# EAGLE board Welder_PSU (EAGLE 9.6.2), part 1 of 2
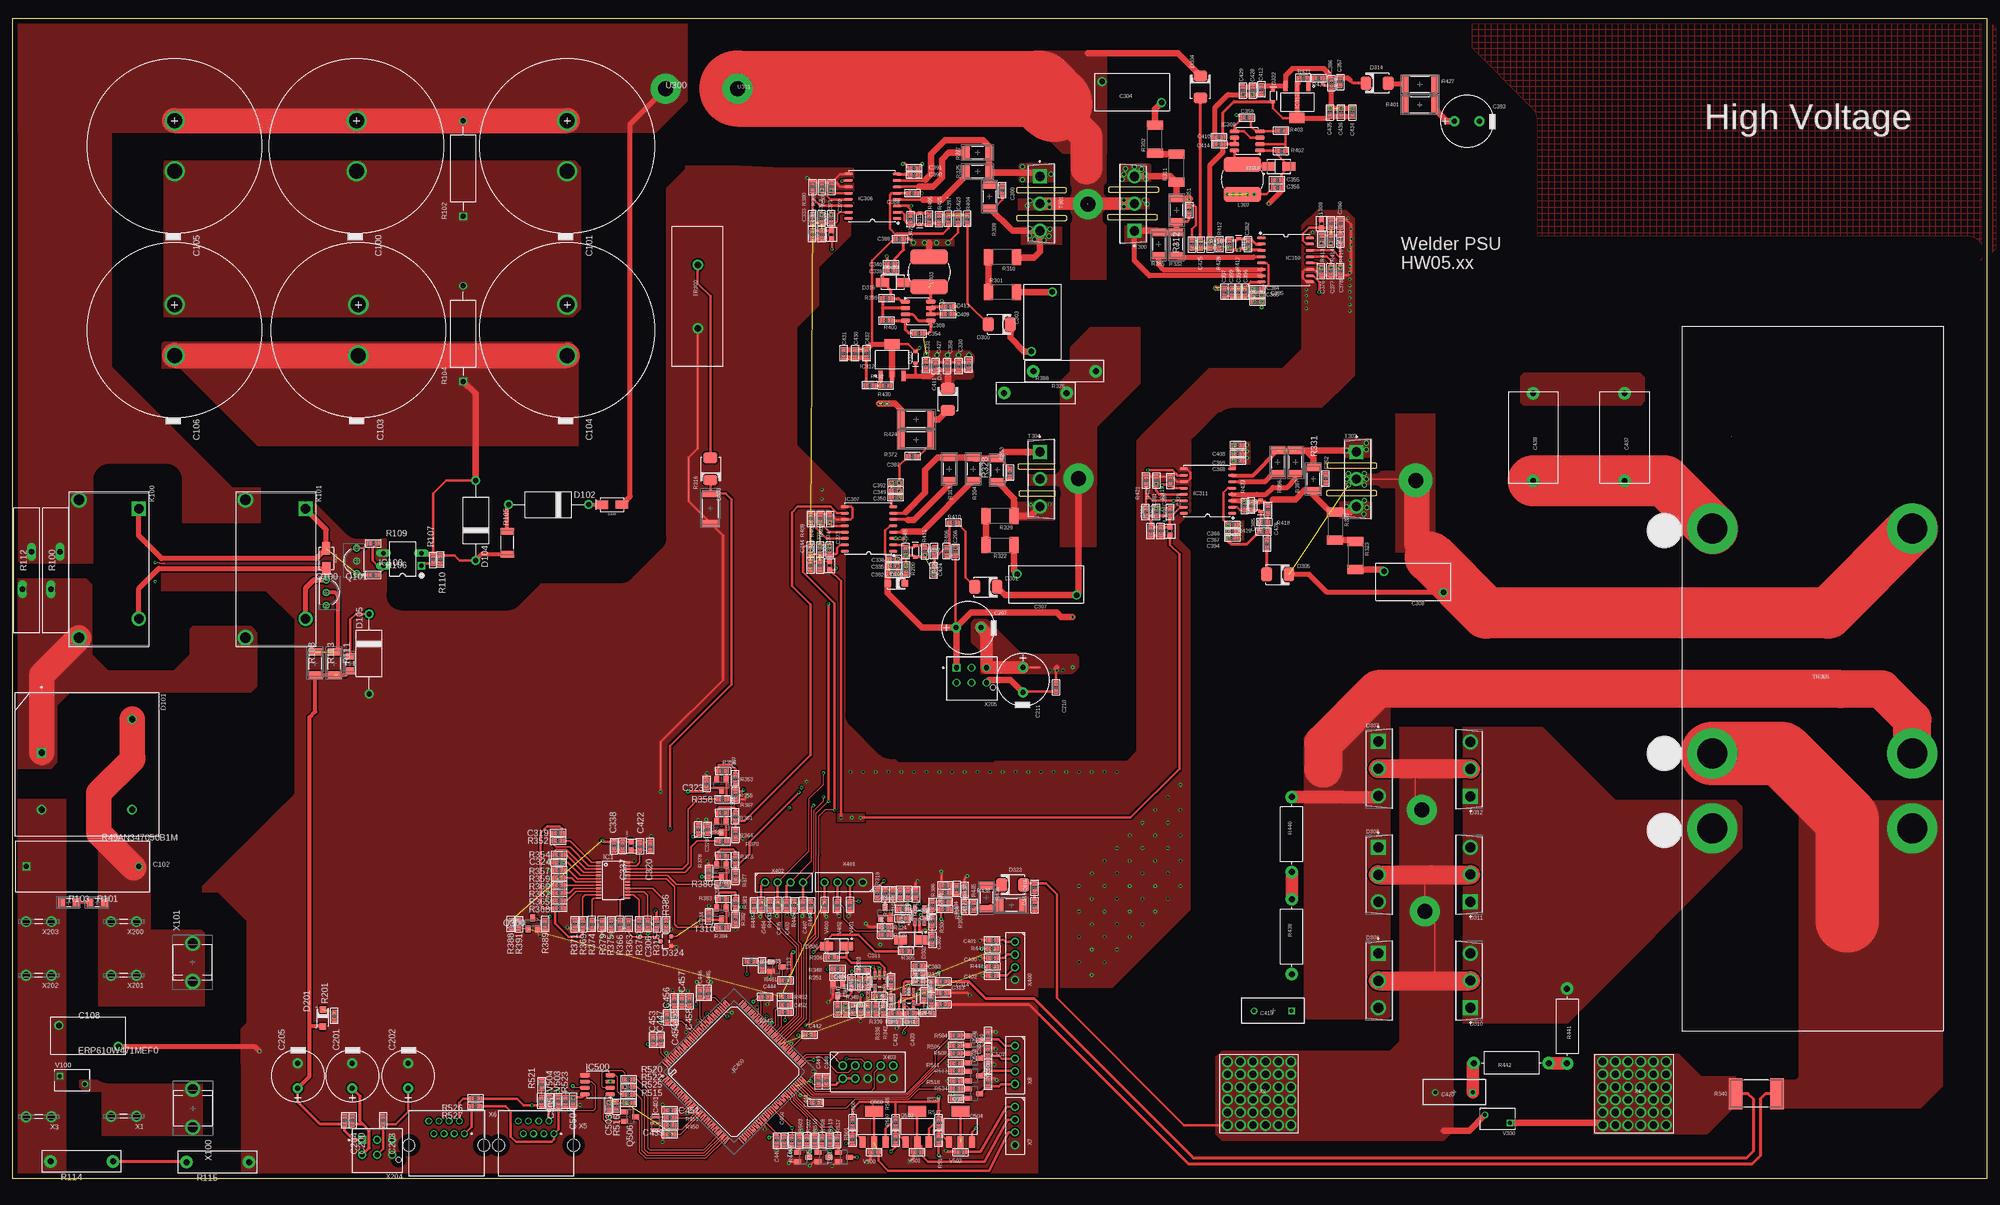
[diagram p6: board, top side]
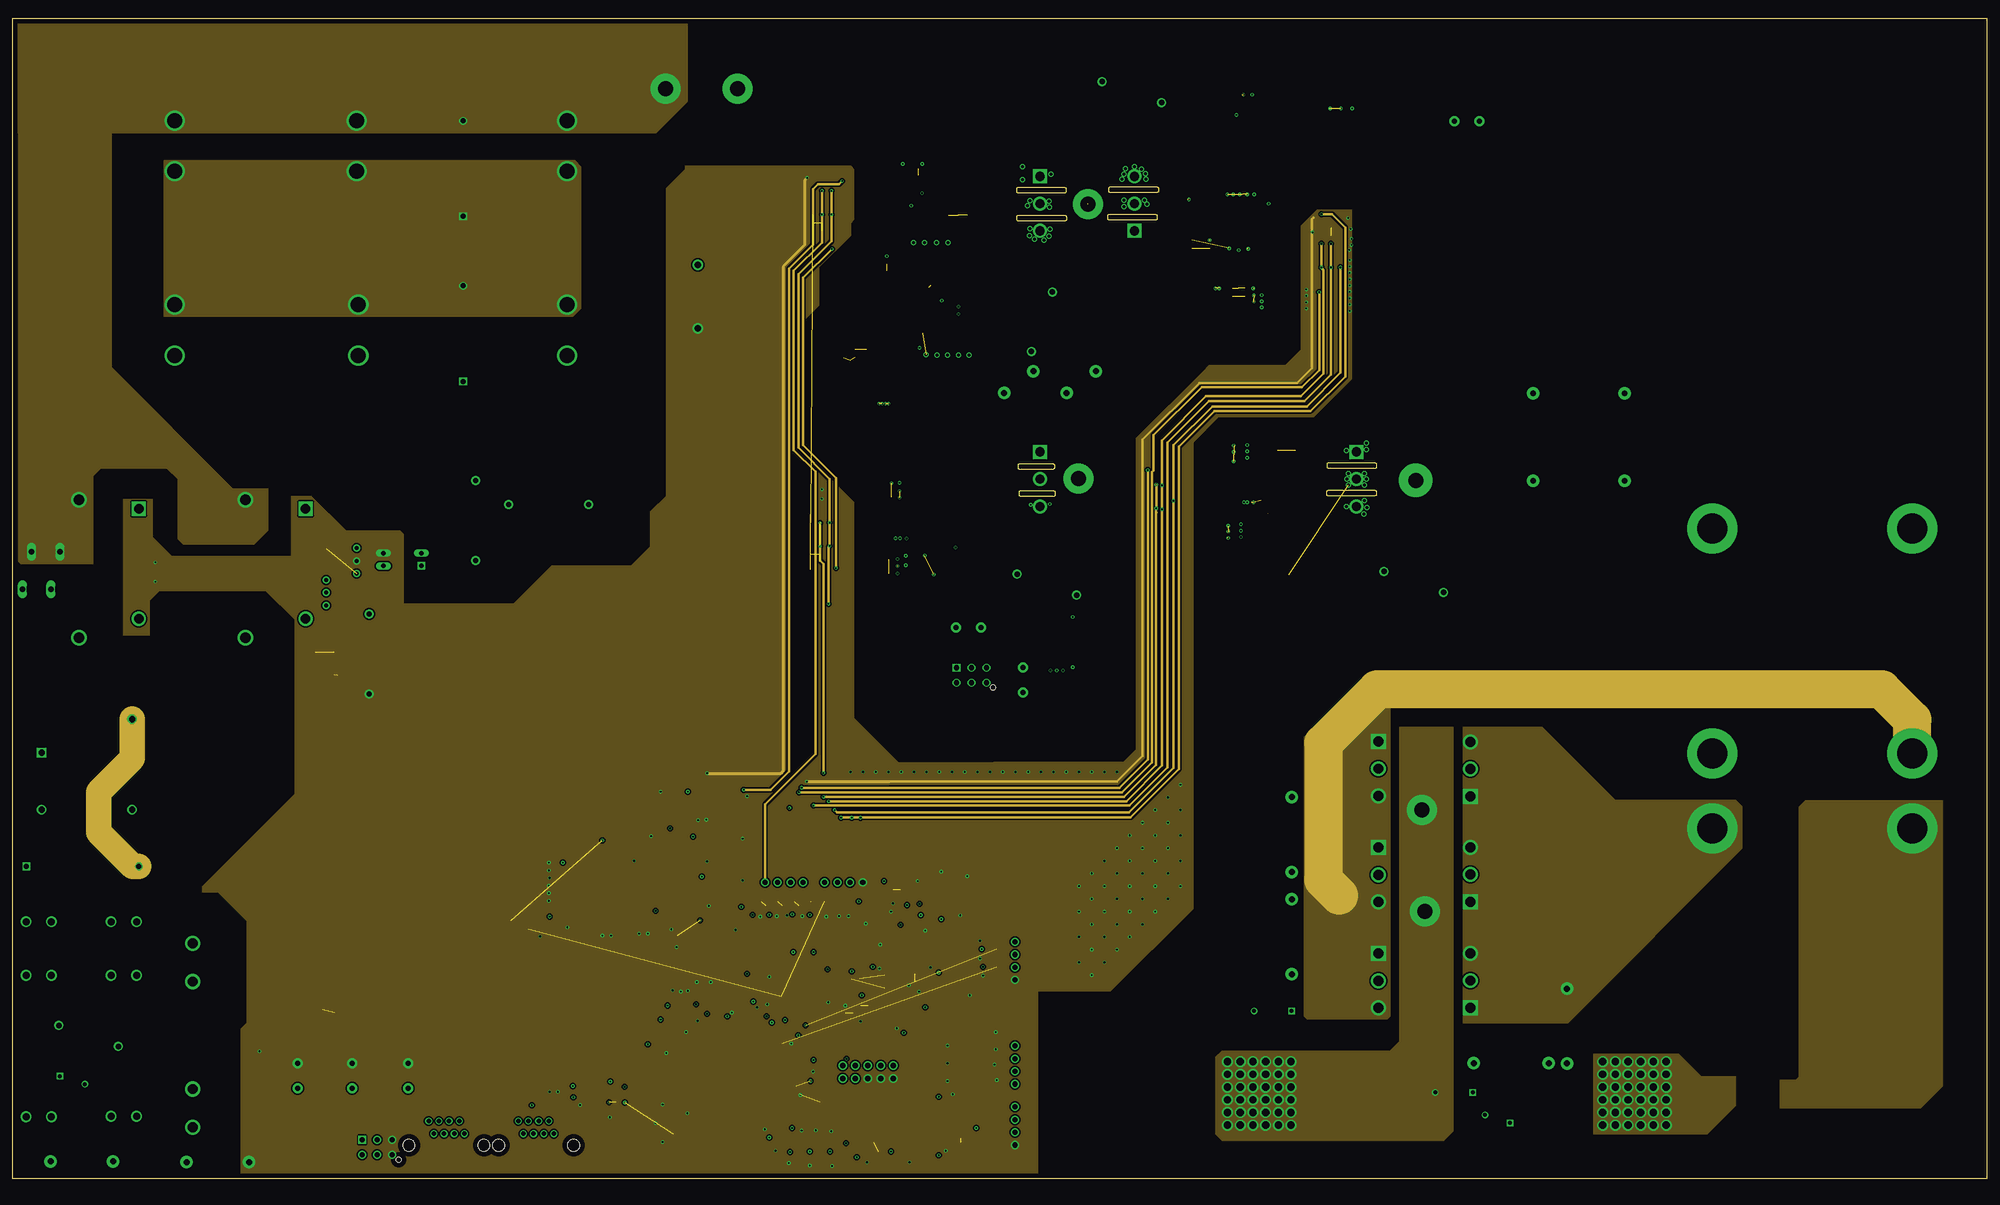
[diagram p7: board, inner layer L1]
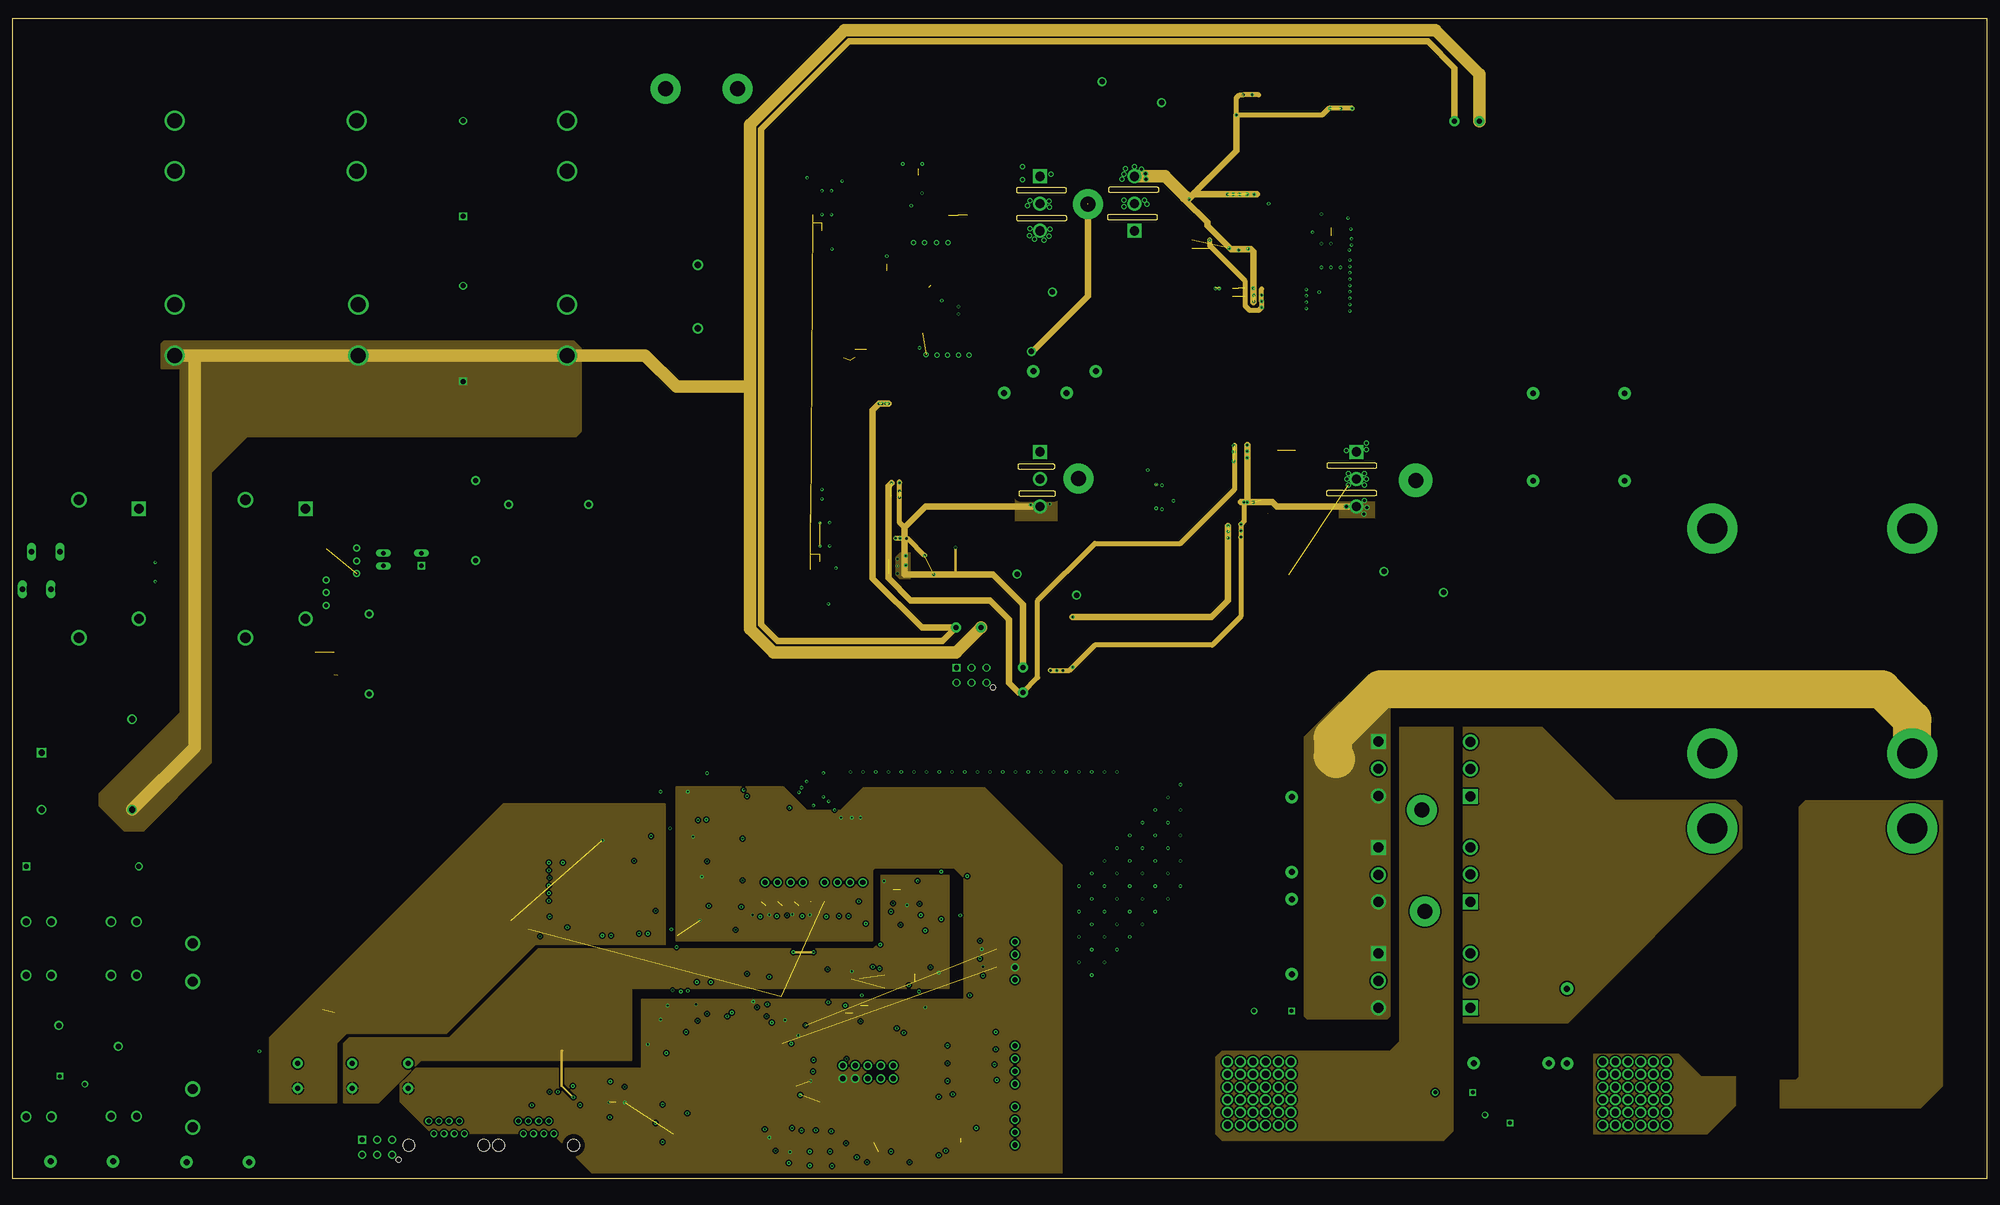
[diagram p8: board, inner layer L2]
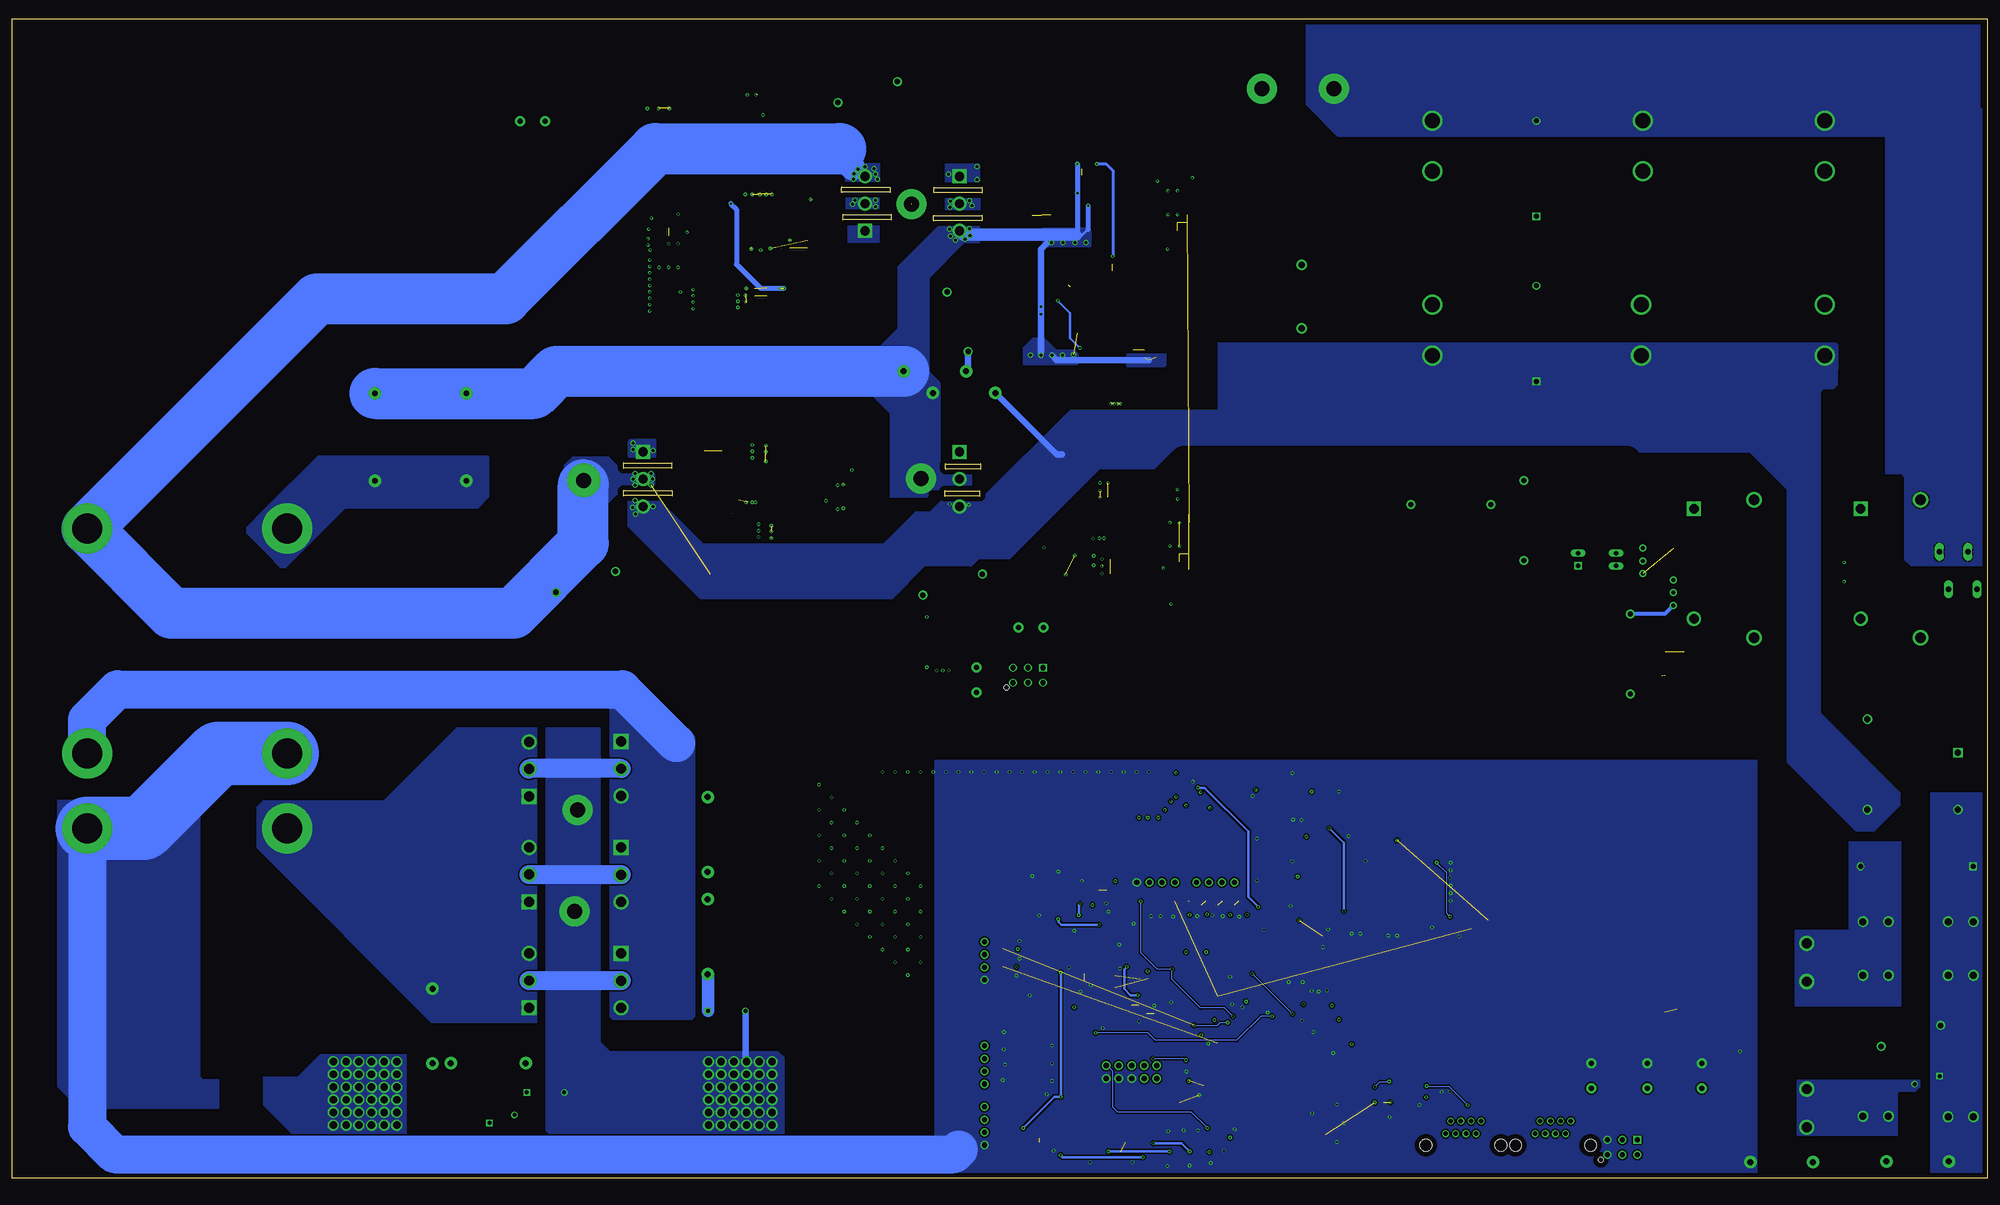
[diagram p9: board, bottom side, seen from below]

Size 395.02 x 232 mm. Coordinates in mm from the lower left corner, seen from the top.
Outline: 0,0 395.02,0 395.02,232 0,232 0,0
Outline: 201.07,191.62 210.67,191.62 arc90 210.82,191.77 210.82,192.43 arc90 210.62,192.63 201.07,192.63 arc90 200.97,192.53 200.97,191.72 arc90 201.07,191.62
Outline: 201.02,197.21 210.62,197.21 arc90 210.77,197.36 210.77,198.02 arc90 210.57,198.22 201.02,198.22 arc90 200.91,198.12 200.91,197.31 arc90 201.02,197.21
Outline: 219.51,197.26 229.11,197.26 arc90 229.26,197.41 229.26,198.07 arc90 229.06,198.27 219.51,198.27 arc90 219.41,198.17 219.41,197.36 arc90 219.51,197.26
Outline: 219.25,191.82 228.85,191.82 arc90 229.01,191.97 229.01,192.63 arc90 228.8,192.84 219.25,192.84 arc90 219.15,192.74 219.15,191.92 arc90 219.25,191.82
Outline: 201.37,141.88 208.28,141.88 arc90 208.43,142.04 208.43,142.7 arc90 208.23,142.9 201.37,142.9 arc90 201.27,142.8 201.27,141.99 arc90 201.37,141.88
Outline: 263.14,142.09 272.75,142.09 arc90 272.9,142.24 272.9,142.9 arc90 272.69,143.1 263.14,143.1 arc90 263.04,143 263.04,142.19 arc90 263.14,142.09
Outline: 263.09,136.55 272.69,136.55 arc90 272.85,136.7 272.85,137.36 arc90 272.64,137.57 263.09,137.57 arc90 262.99,137.47 262.99,136.65 arc90 263.09,136.55
Outline: 201.52,136.5 208.43,136.5 arc90 208.59,136.65 208.59,137.31 arc90 208.38,137.52 201.52,137.52 arc90 201.42,137.41 201.42,136.6 arc90 201.52,136.5
Copper layers (1+2*15+16): Top 0.07mm / dielectric 0.11mm / L1 0.035mm / dielectric 0.12mm / L2 0.035mm / dielectric 0.11mm / Bottom 0.07mm
Design rules "AH_V01 *": minimum track width 0.2mm, minimum drill 0.3mm, track to track 0.3mm, track to pad 0.3mm, pad to pad 0.3mm, via to via 0.3mm, smd to smd 0mil, copper to edge 40mil, drill to drill 6mil, minimum pad ring 0.2mm, minimum via ring 0.15mm, stop-mask expansion 4mil, vias tented up to drill 0mil, thermal gap 10mil
Net classes: 1 L_Net: width 0.2 mm, clearance 6 mm to class 0, clearance 0.2 mm; 2 N_Net: width 0.2 mm, clearance 6 mm to class 0, clearance 3.2 mm to class 1, clearance 0.2 mm; 3 HV_Net+: width 0.2 mm, clearance 6 mm to class 0, clearance 3.2 mm to class 1, clearance 3.2 mm to class 2, clearance 0.2 mm; 4 HV_Net-: width 0.2 mm, clearance 6 mm to class 0, clearance 3.2 mm to class 1, clearance 3.2 mm to class 2, clearance 3.2 mm to class 3, clearance 0.2 mm; 5 MV_Net: width 0.2 mm, clearance 6 mm to class 0, clearance 1 mm to class 1, clearance 1 mm to class 2, clearance 2 mm to class 3, clearance 2 mm to class 4, clearance 0.2 mm; 6 LV_Net: width 0.2 mm, clearance 0.2 mm to class 0, clearance 6 mm to class 1, clearance 6 mm to class 2, clearance 6 mm to class 3, clearance 6 mm to class 4, clearance 6 mm to class 5, clearance 0.2 mm; 9 Weld+: clearance 1.4 mm to class 7
tRestrict: 82 lines
bRestrict: 15 lines

## Footprints (pad centres in the part's own frame; a part is rotated, then mirrored left to right if it is on the bottom)
CAPACITOR-ELKO-400V-RM10-35X50 = drill 3 pad 4: 1 -5.08,0; 2 5.08,0
R49AN347050B1M = drill 1 pad 1.55 square: 1 -11.25,0 | drill 1 pad 1.55: 2 11.25,0
CAPACITOR-FILM-RM12.5MM-12MM = drill 1.1 pad 1.8: 1 6,-2.5; 2 -5.9,1.7
EIA0603 = smd 1 x 1: 1 -0.8,0; 2 0.8,0
CAPACITOR-ELKO-RM5-10X16 = drill 1 pad 2: 1 -2.5,0; 2 2.5,0
C_DISC_P7.5D12 = drill 0.8 pad 1.3 square: 1 -3.75,0 | drill 0.8 pad 1.3: 2 3.75,0
CAPACITOR-FILM-RM17.5-28X17.5X25 = drill 1.1 pad 2.5: 1 -8.75,0; 2 8.75,0
SMA-DIODE = smd 2.5 x 1.6: A -2,0 | smd 2.5 x 1.7: C 2,0
GBPC3510W = drill 1.25 pad 1.9 square: 1 -2.35,-9.05 | drill 1.25 pad 1.9: 2 -9.05,9.05; 3 9.05,9.05; 4 9.05,-9.05
DO-201AD = drill 1 pad 1.8: A -8,0; K 8,0
SMD1206-LED = smd 1.3 x 1.3: 1 -1.7,0; 2 1.7,0
SMB = smd 2.16 x 2.74: A -2.21,0; K 2.21,0
SMA = smd 2.65 x 1.75: 1 -2.015,0; 2 2.015,0
TO-247AD = drill 1.99 square: 1 -0.227,5.46 | drill 1.99: 2 -0.227,0; 3 -0.227,-5.46
SOD-323 = smd 0.63 x 0.83: A 1.15,0; C -1.15,0
SOT23DUALDIODE = smd 0.8 x 0.9: 1 -0.95,-1.05; 2 0.95,-1.05; 3 0,1.05
TSSOP24 = smd 0.305 x 0.991: 1 -3.575,-2.918; 2 -2.925,-2.918; 3 -2.275,-2.918; 4 -1.625,-2.918; 5 -0.975,-2.918; 6 -0.325,-2.918; 7 0.325,-2.918; 8 0.975,-2.918; 9 1.625,-2.918; 10 2.275,-2.918; 11 2.925,-2.918; 12 3.575,-2.918; 13 3.575,2.918; 14 2.925,2.918; 15 2.275,2.918; 16 1.625,2.918; 17 0.975,2.918; 18 0.325,2.918; 19 -0.325,2.918; 20 -0.975,2.918; 21 -1.625,2.918; 22 -2.275,2.918; 23 -2.925,2.918; 24 -3.575,2.918
DIP04 = drill 0.9 pad 1.5 square: 1 -3.81,1.27 | drill 0.9 pad 1.5 long: 2 -3.81,-1.27; 3 3.81,-1.27; 4 3.81,1.27
SOT-23-5 = smd 1.626 x 0.61: 1 -1.245,0.95; 2 -1.245,0; 3 -1.245,-0.95; 4 1.245,-0.95; 5 1.245,0.95
SOIC16_WIDE_HV = smd 1.65 x 0.6: 1 -4.855,4.445; 2 -4.855,3.175; 3 -4.855,1.905; 4 -4.855,0.635; 5 -4.855,-0.635; 6 -4.855,-1.905; 7 -4.855,-3.175; 8 -4.855,-4.445; 9 4.855,-4.445; 10 4.855,-3.175; 11 4.855,-1.905; 12 4.855,-0.635; 13 4.855,0.635; 14 4.855,1.905; 15 4.855,3.175; 16 4.855,4.445
SOIC8 = smd 1.9 x 0.72: 1 -2.54,1.905; 2 -2.54,0.635; 3 -2.54,-0.635; 4 -2.54,-1.905; 5 2.54,-1.905; 6 2.54,-0.635; 7 2.54,0.635; 8 2.54,1.905
SOT223_LM317AEMP = smd 2.05 x 1: 1 -3.175,2.3; 2 -3.175,0; 3 -3.175,-2.3 | smd 2.05 x 3.25: 4 3.175,0
LQFP-144-M = smd 1.45 x 0.3: 1 -10.725,8.75; 2 -10.725,8.25; 3 -10.725,7.75; 4 -10.725,7.25; 5 -10.725,6.75; 6 -10.725,6.25; 7 -10.725,5.75; 8 -10.725,5.25; 9 -10.725,4.75; 10 -10.725,4.25; 11 -10.725,3.75; 12 -10.725,3.25; 13 -10.725,2.75; 14 -10.725,2.25; 15 -10.725,1.75; 16 -10.725,1.25; 17 -10.725,0.75; 18 -10.725,0.25; 19 -10.725,-0.25; 20 -10.725,-0.75; 21 -10.725,-1.25; 22 -10.725,-1.75; 23 -10.725,-2.25; 24 -10.725,-2.75; 25 -10.725,-3.25; 26 -10.725,-3.75; 27 -10.725,-4.25; 28 -10.725,-4.75; 29 -10.725,-5.25; 30 -10.725,-5.75; 31 -10.725,-6.25; 32 -10.725,-6.75; 33 -10.725,-7.25; 34 -10.725,-7.75; 35 -10.725,-8.25; 36 -10.725,-8.75; 73 10.725,-8.75; 74 10.725,-8.25; 75 10.725,-7.75; 76 10.725,-7.25; 77 10.725,-6.75; 78 10.725,-6.25; 79 10.725,-5.75; 80 10.725,-5.25; 81 10.725,-4.75; 82 10.725,-4.25; 83 10.725,-3.75; 84 10.725,-3.25; 85 10.725,-2.75; 86 10.725,-2.25; 87 10.725,-1.75; 88 10.725,-1.25; 89 10.725,-0.75; 90 10.725,-0.25; 91 10.725,0.25; 92 10.725,0.75; 93 10.725,1.25; 94 10.725,1.75; 95 10.725,2.25; 96 10.725,2.75; 97 10.725,3.25; 98 10.725,3.75; 99 10.725,4.25; 100 10.725,4.75; 101 10.725,5.25; 102 10.725,5.75; 103 10.725,6.25; 104 10.725,6.75; 105 10.725,7.25; 106 10.725,7.75; 107 10.725,8.25; 108 10.725,8.75 | smd 0.3 x 1.45: 37 -8.75,-10.725; 38 -8.25,-10.725; 39 -7.75,-10.725; 40 -7.25,-10.725; 41 -6.75,-10.725; 42 -6.25,-10.725; 43 -5.75,-10.725; 44 -5.25,-10.725; 45 -4.75,-10.725; 46 -4.25,-10.725; 47 -3.75,-10.725; 48 -3.25,-10.725; 49 -2.75,-10.725; 50 -2.25,-10.725; 51 -1.75,-10.725; 52 -1.25,-10.725; 53 -0.75,-10.725; 54 -0.25,-10.725; 55 0.25,-10.725; 56 0.75,-10.725; 57 1.25,-10.725; 58 1.75,-10.725; 59 2.25,-10.725; 60 2.75,-10.725; 61 3.25,-10.725; 62 3.75,-10.725; 63 4.25,-10.725; 64 4.75,-10.725; 65 5.25,-10.725; 66 5.75,-10.725; 67 6.25,-10.725; 68 6.75,-10.725; 69 7.25,-10.725; 70 7.75,-10.725; 71 8.25,-10.725; 72 8.75,-10.725; 109 8.75,10.725; 110 8.25,10.725; 111 7.75,10.725; 112 7.25,10.725; 113 6.75,10.725; 114 6.25,10.725; 115 5.75,10.725; 116 5.25,10.725; 117 4.75,10.725; 118 4.25,10.725; 119 3.75,10.725; 120 3.25,10.725; 121 2.75,10.725; 122 2.25,10.725; 123 1.75,10.725; 124 1.25,10.725; 125 0.75,10.725; 126 0.25,10.725; 127 -0.25,10.725; 128 -0.75,10.725; 129 -1.25,10.725; 130 -1.75,10.725; 131 -2.25,10.725; 132 -2.75,10.725; 133 -3.25,10.725; 134 -3.75,10.725; 135 -4.25,10.725; 136 -4.75,10.725; 137 -5.25,10.725; 138 -5.75,10.725; 139 -6.25,10.725; 140 -6.75,10.725; 141 -7.25,10.725; 142 -7.75,10.725; 143 -8.25,10.725; 144 -8.75,10.725
CSTNE8M00G520000R0 = smd 0.4 x 1.9: 1 -1.2,0; 2 0,0; 3 1.2,0
PANASONIC_ALFG2PF09_0 = drill 1.9 pad 2.4 square: 1 0,0 | drill 1.9 pad 2.4: 2 22,0 | drill 2.1 pad 2.6: 3 -1.8,-12; 4 25.8,-12
0603 = smd 1.1 x 1: 1 -0.85,0; 2 0.85,0
SRN8040TA-220M = smd 3 x 7.5: 1 -3,0; 2 3,0
TO-92 = drill 0.8 pad 1.4: 1 0,2.54; 2 0,0; 3 0,-2.54
SOT23 = smd 1 x 1.4: 1 -0.95,-1.1; 2 0.95,-1.1; 3 0,1.1
SOT223 = smd 1.219 x 2.235: 1 -2.311,-3.099; 2 0,-3.099; 3 2.311,-3.099 | smd 3.6 x 2.2: 4 0,3.099
VARISTOR_D25_P7.5 = drill 1.1 pad 1.8 long: 1 -3.75,0.925; 2 3.75,-0.925
EIA1206 = smd 1.3 x 1.8: 1 -1.45,0; 2 1.45,0
ERG-2S = drill 1 pad 1.55 square: 1 -9.555,0 | drill 1 pad 1.55: 2 9.555,0
R2010 = smd 1.256 x 2.658: 1 -2.301,0; 2 2.301,0
EIA2010 = smd 1.4 x 2.7: 1 -2.3,0; 2 2.3,0
RES-RM12.5-VR37 = drill 1.2 pad 2.5: 1 -6.25,0; 2 6.25,0
R2512 = smd 1.8 x 3.2: 1 -2.8,0; 2 2.8,0
EIA2512 = smd 1.3 x 3.4: 1 -2.95,0; 2 2.95,0
WSLP3921 = smd 2.7 x 6.2: 1 -4.15,0; 2 4.15,0
RES-RM15-RSF1W = drill 1.2 pad 2.5: 1 -7.5,0; 2 7.5,0
TO-247AC = drill 1.85 pad 2.8 square: 1 -0.227,5.46 | drill 1.85 pad 2.8: 2 -0.227,0; 3 -0.227,-5.46
CST206-2A = drill 1.27 pad 2.083: 1 -6.35,0; 2 6.35,0
11-0060-A = drill 6 pad 10: 1 -20,30; 2 -20,-15; 3 -20,-30; 4 20,-30; 5 20,-15; 6 20,30
PAD-3.0X6.0MM = drill 3 pad 6: 1 0,0
EPCOS_B72205S0271K101_0 = drill 0.8 pad 1.3 square: 1 -2.5,0.8 | drill 0.8 pad 1.3: 2 2.5,-0.8
TE_726386-2 = drill 1.4 pad 2.15: 1 -2.54,0; 1-2 2.54,0
X01_M10_7461061 = drill 1.45 pad 2.2: 1 -6.35,-6.35; 1-1 -3.81,-6.35; 1-2 -1.27,-6.35; 1-3 1.27,-6.35; 1-4 -6.35,-3.81; 1-5 -3.81,-3.81; 1-6 -1.27,-3.81; 1-7 1.27,-3.81; 1-8 -6.35,-1.27; 1-9 -3.81,-1.27; 1-10 -1.27,-1.27; 1-11 1.27,-1.27; 1-12 -6.35,1.27; 1-13 -3.81,1.27; 1-14 -1.27,1.27; 1-15 1.27,1.27; 1-16 3.81,-6.35; 1-17 3.81,-3.81; 1-18 3.81,-1.27; 1-19 3.81,1.27; 1-20 3.81,3.81; 1-21 1.27,3.81; 1-22 -1.27,3.81; 1-23 -3.81,3.81; 1-24 -6.35,3.81; 1-25 6.35,-1.27; 1-26 6.35,-3.81; 1-27 6.35,-6.35; 1-28 6.35,1.27; 1-29 6.35,3.81; 1-30 -6.35,6.35; 1-31 -3.81,6.35; 1-32 -1.27,6.35; 1-33 1.27,6.35; 1-34 3.81,6.35; 1-35 6.35,6.35
615008148521 = drill 0.9: 1 3.57,1.875; 2 2.55,4.415; 3 1.53,1.875; 4 0.51,4.415; 5 -0.51,1.875; 6 -1.53,4.415; 7 -2.55,1.875; 8 -3.57,4.415 | hole 2.36: -7.5,-0.425; 7.5,-0.425
X04_100MIL = drill 1.016 pad 1.616: 1 0,0; 2 2.54,0; 3 5.08,0; 4 7.62,0
FUSE_CLIP_01020071Z = drill 1.98 pad 3.03: 1 3.81,0; 1-1 -3.81,0
MOLEX_206832-0601 = drill 1.02 pad 1.57 square: 1 3,-2.2 | drill 1.02 pad 1.57: 2 3,0.8; 3 0,-2.2; 4 0,0.8; 5 -3,-2.2; 6 -3,0.8 | hole 1.02: -4.28,1.78
X10_100MIL_2XROW_VERT = drill 1.1 pad 1.7: 1 -5.08,1.27; 2 -5.08,-1.27; 3 -2.54,1.27; 4 -2.54,-1.27; 5 0,1.27; 6 0,-1.27; 7 2.54,1.27; 8 2.54,-1.27; 9 5.08,1.27; 10 5.08,-1.27

## Placement (x,y rotation side)
C100  SLP152M250H9P3  [CAPACITOR-ELKO-400V-RM10-35X50]  68.82,206.53 270 top
C101  SLP152M250H9P3  [CAPACITOR-ELKO-400V-RM10-35X50]  110.98,206.53 270 top
C102  R49AN347050B1M  [R49AN347050B1M]  14.04,62.39 0 top
C103  SLP152M250H9P3  [CAPACITOR-ELKO-400V-RM10-35X50]  69.2,169.7 270 top
C104  SLP152M250H9P3  [CAPACITOR-ELKO-400V-RM10-35X50]  110.98,169.7 270 top
C105  SLP152M250H9P3  [CAPACITOR-ELKO-400V-RM10-35X50]  32.42,206.53 270 top
C106  SLP152M250H9P3  [CAPACITOR-ELKO-400V-RM10-35X50]  32.42,169.7 270 top
C108  ERP610W471MEF0  [CAPACITOR-FILM-RM12.5MM-12MM]  15.16,28.86 0 top
C200  100nF/50V  [EIA0603]  68,11.59 270 top
C201  50PX470MEFC10X20  [CAPACITOR-ELKO-RM5-10X16]  68,20.48 90 top
C202  50PX470MEFC10X20  [CAPACITOR-ELKO-RM5-10X16]  79.17,20.48 90 top
C203  100nF/50V  [EIA0603]  74.09,11.59 270 top
C204  100nF/50V  [EIA0603]  66.47,11.59 270 top
C205  50PX470MEFC10X20  [CAPACITOR-ELKO-RM5-10X16]  57.07,20.48 90 top
C206  100nF/50V  [EIA0603]  188.65,125.38 270 top
C207  50PX470MEFC10X20  [CAPACITOR-ELKO-RM5-10X16]  191.24,110.14 0 top
C210  100nF/50V  [EIA0603]  208.71,98.2 270 top
C211  50PX470MEFC10X20  [CAPACITOR-ELKO-RM5-10X16]  202.16,99.73 270 top
C300  470pF/50V  [EIA0603]  198.04,197.64 90 top
C301  12pF/50V  [EIA0603]  178.16,52.02 0 top
C302  510pF/50V  [EIA0603]  184,47.7 270 top
C303  HVCC153Y6P471MEAX  [CAPACITOR-FILM-RM12.5MM-12MM]  206.32,171.41 270 top
C304  HVCC153Y6P471MEAX  [CAPACITOR-FILM-RM12.5MM-12MM]  224,216.93 180 top
C305  100nF/50V  [EIA0603]  186.54,53.8 180 top
C306  330pF/50V  [EIA0603]  127.1,50.81 90 top
C307  HVCC153Y6P471MEAX  [CAPACITOR-FILM-RM12.5MM-12MM]  206.88,119.18 0 top
C308  HVCC153Y6P471MEAX  [CAPACITOR-FILM-RM12.5MM-12MM]  280.29,119.69 0 top
C309  100nF/50V  [EIA0603]  179.17,56.84 90 top
C310  100nF/50V  [EIA0603]  176.13,56.84 270 top
C311  12pF/50V  [EIA0603]  169.42,39.09 90 top
C312  510pF/50V  [EIA0603]  170.06,41.63 180 top
C313  10nF/50V  [EIA0603]  183.9,38.58 90 top
C314  1nF/50V  [EIA0603]  186.19,37.06 0 top
C315  22uF/16V  [EIA0603]  173.45,36.4 180 top
C316  10nF/50V  [EIA0603]  183.9,35.53 90 top
C317  100nF/50V  [EIA0603]  169.68,33.76 270 top
C318  100nF/50V  [EIA0603]  166.63,33.76 90 top
C319  1uF/25V  [EIA0603]  109.14,68.99 180 top
C320  100nF/50V  [EIA0603]  125.5,66.4 270 top
C323  100nF/50V  [EIA0603]  138.78,78.89 270 top
C324  100nF/50V  [EIA0603]  109.32,63.15 0 top
C325  1uF/25V  [EIA0603]  137.26,69.75 90 top
C328  100nF/50V  [EIA0603]  139.03,69.75 270 top
C329  100nF/50V  [EIA0603]  139.29,61.11 270 top
C330  100nF/100V  [EIA0603]  191.34,162.69 90 top
C331  10uF/25V  [EIA0603]  184.73,162.44 90 top
C332  100nF/50V  [EIA0603]  161.93,188.83 90 top
C333  100nF/50V  [EIA0603]  160.03,188.83 90 top
C334  100nF/50V  [EIA0603]  139.29,52.48 270 top
C335  100nF/50V  [EIA0603]  176.19,122.54 180 top
C336  10uF/35V  [EIA0603]  176.19,123.81 180 top
C337  1uF/25V  [EIA0603]  120.32,66.45 270 top
C338  100nF/50V  [EIA0603]  122.1,66.45 90 top
C339  10uF/35V  [EIA0603]  175.72,181.61 180 top
C340  4.7uF/50V  [EIA0603]  175.72,182.88 180 top
C342  1nF/50V  [EIA0603]  179.63,191.93 270 top
C343  100nF/50V  [EIA0603]  161.58,122.54 90 top
C344  1uF/50V  [EIA0603]  159.68,122.54 90 top
C345  1nF/50V  [EIA0603]  178.7,125.4 90 top
C346  100nF/50V  [EIA0603]  178.16,53.8 180 top
C347  100nF/50V  [EIA0603]  182.38,36.55 90 top
C348  100nF/50V  [EIA0603]  175.77,39.34 90 top
C349  100nF/50V  [EIA0603]  176.66,137.51 180 top
C350  2.2uF/35V  [EIA0603]  176.66,136.24 180 top
C351  470pF/50V  [EIA0603]  235.38,193.71 270 top
C352  470pF/50V  [EIA0603]  262.76,139.98 90 top
C353  470pF/50V  [EIA0603]  199.57,141.13 90 top
C354  100nF/50V  [EIA0603]  181.28,169.07 0 top
C355  10uF/35V  [EIA0603]  253.05,199.73 0 top
C356  4.7uF/50V  [EIA0603]  253.05,198.2 0 top
C357  100nF/100V  [EIA0603]  265.61,219.36 270 top
C358  10uF/35V  [EIA0603]  189.31,162.44 90 top
C359  100nF/25V  [EIA0603]  246.96,212.17 180 top
C360  1uF/35V  [EIA0603]  265.65,190.98 270 top
C361  100nF/50V  [EIA0603]  263.75,190.98 270 top
C362  1nF/50V  [EIA0603]  247.2,186.85 90 top
C363  100nF/50V  [EIA0603]  229.72,129.44 90 top
C364  100nF/50V  [EIA0603]  227.73,129.44 90 top
C365  1nF/50V  [EIA0603]  246.55,134.53 270 top
C366  100nF/50V  [EIA0603]  244.02,130.65 180 top
C367  10uF/35V  [EIA0603]  244.02,129.38 180 top
C368  100nF/50V  [EIA0603]  245.12,143.54 180 top
C369  2.2uF/35V  [EIA0603]  245.12,144.81 180 top
C370  100pF/50V  [EIA0603]  163.84,198.35 270 top
C371  100pF/50V  [EIA0603]  161.93,198.35 270 top
C372  100pF/50V  [EIA0603]  160.03,198.35 270 top
C373  100pF/50V  [EIA0603]  163.49,131.94 270 top
C374  100pF/50V  [EIA0603]  161.58,131.94 270 top
C375  100pF/50V  [EIA0603]  159.68,131.94 270 top
C376  100pF/50V  [EIA0603]  261.84,181.45 90 top
C377  100pF/50V  [EIA0603]  263.75,181.45 90 top
C378  100pF/50V  [EIA0603]  265.65,181.45 90 top
C379  100pF/50V  [EIA0603]  231.62,139.54 270 top
C380  100pF/50V  [EIA0603]  228.78,139.6 270 top
C381  100pF/50V  [EIA0603]  226.75,139.6 270 top
C382  10F/35V  [EIA0603]  176.16,120.95 180 top
C383  100pF/25V  [EIA0603]  181.32,42.5 180 top
C384  4.7uF/35V  [EIA0603]  249.11,177.96 0 top
C385  100nF/25V  [EIA0603]  249.11,176.69 0 top
C386  10uF/35V  [EIA0603]  263.83,219.11 270 top
C387  100nF/100V  [EIA0603]  180.01,144.43 180 top
C388  10uF/25V  [EIA0603]  180.01,197.01 180 top
C389  10uF/25V  [EIA0603]  177.47,187.87 180 top
C390  10uF/35V  [EIA0603]  180.32,200.73 180 top
C391  10uF/35V  [EIA0603]  180.32,202 180 top
C392  10uF/35V  [EIA0603]  176.66,139.12 180 top
C393  470uF/35V  [CAPACITOR-ELKO-RM5-10X16]  291.01,211.49 0 top
C394  10F/35V  [EIA0603]  244.01,128.18 180 top
C395  10uF/25V  [EIA0603]  249.11,175.42 0 top
C396  10uF/25V  [EIA0603]  246.57,177.32 90 top
C397  10uF/25V  [EIA0603]  242.49,177.32 90 top
C398  10uF/35V  [EIA0603]  245.3,177.32 90 top
C399  10uF/35V  [EIA0603]  244.03,177.32 90 top
C400  100nF/50V  [EIA0603]  196.01,44.1 0 top
C401  100nF/50V  [EIA0603]  196.01,47.66 0 top
C402  100nF/50V  [EIA0603]  196.01,40.55 0 top
C403  100nF/50V  [EIA0603]  154.87,54.62 90 top
C404  100nF/50V  [EIA0603]  149.79,54.62 90 top
C405  100nF/50V  [EIA0603]  153.09,54.62 90 top
C407  100nF/50V  [EIA0603]  158.17,54.62 90 top
C408  10uF/35V  [EIA0603]  245.12,146.59 180 top
C409  4.7uF/50V  [EIA0603]  187.12,172.88 180 top
C410  4.7uF/50V  [EIA0603]  241.37,208.36 0 top
C411  100nF/50V  [EIA0603]  182.7,162.69 270 top
C412  100nF/50V  [EIA0603]  249.88,217.83 90 top
C413  100nF/100V  [EIA0603]  187.12,174.4 0 top
C414  100nF/100V  [EIA0603]  241.37,206.84 180 top
C415  100nF/100V  [EIA0603]  204.45,58.17 270 top
C416  10uF/25V  [EIA0603]  186.61,58.58 180 top
C417  10uF/25V  [EIA0603]  190.48,57.66 90 top
C418  100nF/100V  [EIA0603]  204.45,54.62 270 top
C419  CK45-B3FD102KYVNA  [C_DISC_P7.5D12]  252.15,33.43 180 top
C420  CK45-B3FD102KYVNA  [C_DISC_P7.5D12]  288.4,17.18 180 top
C421  10nF/50V  [EIA0603]  176.45,31.23 180 top
C422  1uF/25V  [EIA0603]  127.6,66.4 90 top
C423  330pF/50V  [EIA0603]  189.15,191.93 90 top
C424  330pF/50V  [EIA0603]  184.33,121.57 90 top
C425  330pF/50V  [EIA0603]  235.92,186.85 270 top
C426  330pF/50V  [EIA0603]  251.13,133.76 270 top
C427  10uF/35V  [EIA0603]  187.02,162.44 90 top
C428  10uF/35V  [EIA0603]  248.1,217.63 270 top
C429  10uF/25V  [EIA0603]  246.07,217.63 270 top
C430  10uF/35V  [EIA0603]  168.58,165.01 90 top
C431  10uF/35V  [EIA0603]  166.29,165.01 90 top
C432  10uF/35V  [EIA0603]  170.87,165.01 90 top
C433  100pF/25V  [EIA0603]  179.75,31.23 180 top
C434  10uF/35V  [EIA0603]  268.04,213.24 270 top
C435  10uF/35V  [EIA0603]  263.47,213.24 270 top
C436  10uF/35V  [EIA0603]  265.75,213.24 270 top
C437  ECW-F4245JLB  [CAPACITOR-FILM-RM17.5-28X17.5X25]  322.5,148.24 270 top
C438  ECW-F4245JLB  [CAPACITOR-FILM-RM17.5-28X17.5X25]  304.22,148.24 270 top
C439  100nF/50V  [EIA0603]  131.5,8.8 0 top
C440  100nF/50V  [EIA0603]  152.86,7.53 270 top
C441  100nF/50V  [EIA0603]  160.73,15.15 0 top
C442  100nF/50V  [EIA0603]  159.39,28.68 180 top
C443  100nF/50V  [EIA0603]  154.61,33.18 180 top
C444  100nF/50V  [EIA0603]  150.55,36.23 180 top
C445  100nF/50V  [EIA0603]  139.12,36.99 90 top
C446  100nF/50V  [EIA0603]  137.59,36.99 90 top
C447  100nF/50V  [EIA0603]  129.72,27.59 90 top
C448  1uF/35V  [EIA0603]  162.74,19.46 270 top
C449  100nF/50V  [EIA0603]  161.21,19.46 270 top
C450  100nF/50V  [EIA0603]  154.38,7.53 270 top
C451  100nF/50V  [EIA0603]  131.52,13.62 0 top
C452  100nF/50V  [EIA0603]  154.61,34.7 0 top
C453  1uF/50V  [EIA0603]  128.19,27.59 90 top
C454  1uF/35V  [EIA0603]  132.51,32.16 90 top
C455  1uF/35V  [EIA0603]  132.45,35.36 90 top
C456  100nF/50V  [EIA0603]  130.99,32.16 90 top
C457  100nF/50V  [EIA0603]  133.98,35.36 90 top
C458  10uF/16V  [EIA0603]  135.5,35.36 90 top
C500  100nF/50V  [EIA0603]  195.17,28.59 90 top
C501  100nF/50V  [EIA0603]  195.17,25.29 90 top
C502  100nF/50V  [EIA0603]  195.17,22.24 90 top
C503  100nF/50V  [EIA0603]  119.33,14.38 90 top
C504  100nF/50V  [EIA0603]  112.19,15.4 90 top
C505  100nF/50V  [EIA0603]  105.84,18.66 270 top
C506  100nF/50V  [EIA0603]  195.17,19.2 90 top
D100  RS1M-13-F  [SMA-DIODE]  119.94,134.78 180 top
D101  GBPC3510W  [GBPC3510W]  14.9,82.8 270 top
D102  1N5387BRLG  [DO-201AD]  107.24,134.78 0 top
D103  RS1M-13-F  [SMA-DIODE]  62.79,123.98 270 top
D104  1N4739A  [DO-201AD]  92.63,131.6 270 top
D105  1N4739A  [DO-201AD]  71.36,104.91 90 top
D200  26-21/GPC-F3138B/CA  [SMD1206-LED]  176.79,119.05 0 top
D201  26-21/GPC-F3138B/CA  [SMD1206-LED]  62.1,32.05 90 top
D300  STTH1R04USMB  [SMB]  197.44,170.85 0 top
D301  STTH1R04USMB  [SMB]  194.74,118.32 0 top
D302  SS14  [SMA]  179.68,47.7 180 top
D303  STTH1R04USMB  [SMB]  139.62,141.89 270 top
D304  STTH1R04USMB  [SMB]  237.67,218.35 90 top
D305  STTH1R04USMB  [SMB]  253.16,120.81 0 top
D306  SS14  [SMA]  164.85,46.46 180 top
D307  FEP30DP-E3/45TO-247AD  [TO-247AD]  273.45,81.93 0 top
D308  FEP30DP-E3/45TO-247AD  [TO-247AD]  273.45,60.72 0 top
D309  FEP30DP-E3/45TO-247AD  [TO-247AD]  273.45,39.51 0 top
D310  FEP30DP-E3/45TO-247AD  [TO-247AD]  291.45,39.53 180 top
D311  FEP30DP-E3/45TO-247AD  [TO-247AD]  291.45,60.76 180 top
D312  FEP30DP-E3/45TO-247AD  [TO-247AD]  291.45,81.84 180 top
D313  GB02SLT12-214  [SMB]  187.12,155.86 90 top
D314  GB02SLT12-214  [SMB]  272.97,219.11 180 top
D315  SD103AW  [SOD-323]  181.53,191.93 90 top
D316  SS14  [SMA]  176.1,179.2 180 top
D317  SD103AW  [SOD-323]  180.6,125.4 270 top
D318  SS14  [SMA]  253.36,202.46 0 top
D319  SD103AW  [SOD-323]  245.3,186.85 270 top
D320  SD103AW  [SOD-323]  249.72,134.53 90 top
D321  SD103AW  [SOD-323]  180.67,164.22 90 top
D322  SD103AW  [SOD-323]  252.19,216.56 270 top
D323  STTH1R04USMB  [SMB]  200.13,58.68 180 top
D324  BAT54S  [SOT23DUALDIODE]  130.73,47.4 90 top
IC1  UCC28951PWR  [TSSOP24]  120.18,59.6 270 top
IC100  PC817  [DIP04]  78.03,123.77 180 top
IC300  LMV641  [SOT-23-5]  181.46,52.53 90 top
IC301  LMV641  [SOT-23-5]  179.33,36.04 270 top
IC302  LMV641  [SOT-23-5]  173.49,39.34 270 top
IC306  UCC21710  [SOIC16_WIDE_HV]  172.09,196.45 180 top
IC307  UCC21710  [SOIC16_WIDE_HV]  171.35,129.89 180 top
IC308  MAX764CSA+  [SOIC8]  181.18,173.48 0 top
IC309  MAX764CSA+  [SOIC8]  247.01,207.54 180 top
IC310  UCC21710  [SOIC16_WIDE_HV]  254.73,183.74 0 top
IC311  UCC21710  [SOIC16_WIDE_HV]  239.15,137.45 180 top
IC312  LM317AEMP  [SOT223_LM317AEMP]  175.97,163.71 90 top
IC313  LM317AEMP  [SOT223_LM317AEMP]  256.97,215.3 270 top
IC400  R7FA6M5BG3CFBLQFP-144-M  [LQFP-144-M]  144.38,21.3 45 top
IC401  CSTNE8M00G520000R0  [CSTNE8M00G520000R0]  128.65,11.02 270 top
IC500  SN65HVD3082EDR  [SOIC8]  117.05,18.7 180 top
K100  PANASONIC_ALFG2PF09PANASONIC_ALFG2PF09_0_0  [PANASONIC_ALFG2PF09_0]  25.26,133.91 270 top
K101  PANASONIC_ALFG2PF09PANASONIC_ALFG2PF09_0_0  [PANASONIC_ALFG2PF09_0]  58.64,133.93 270 top
L300  BLM18RK601SN1D  [0603]  123.79,66.45 90 top
L302  BLM18RK601SN1D  [0603]  163.84,188.83 90 top
L303  SRN8040TA-220M  [SRN8040TA-220M]  183.4,181.31 270 top
L304  BLM18RK601SN1D  [0603]  163.49,122.54 90 top
L307  SRN8040TA-220M  [SRN8040TA-220M]  246.05,199.85 90 top
L308  BLM18RK601SN1D  [0603]  261.84,190.98 270 top
L309  BLM18RK601SN1D  [0603]  231.57,129.44 90 top
Q100  BC640TA  [TO-92]  68.88,123.51 180 top
Q101  KSD1616AYTA  [TO-92]  62.79,117.16 0 top
Q300  2N7002  [SOT23]  104.09,51.01 0 top
Q306  2N7002  [SOT23]  165.1,37.57 180 top
Q500  DMP6185SEQ-13  [SOT223]  172.37,10.32 0 top
Q501  BC817  [SOT23]  192.37,27.58 270 top
Q502  DMP6185SEQ-13  [SOT223]  181.01,10.32 0 top
Q503  BC817  [SOT23]  192.37,24.02 270 top
Q504  DMP6185SEQ-13  [SOT223]  189.64,10.32 0 top
Q505  BC817  [SOT23]  192.37,20.47 270 top
Q506  BC817  [SOT23]  123.57,12.31 270 top
Q507  BC817  [SOT23]  192.37,16.91 270 top
R100  B57364S100M54  [VARISTOR_D25_P7.5]  8.61,121.55 90 top
R101  R_1206EIA1206  [EIA1206]  16.94,55.22 0 top
R102  ERG-2SJ513  [ERG-2S]  90.15,202.01 90 top
R103  R_1206EIA1206  [EIA1206]  11.23,55.22 0 top
R104  ERG-2SJ513  [ERG-2S]  90.15,168.99 90 top
R105  82K 1%  [R2010]  98.98,127.16 90 top
R106  0R  [EIA0603]  72.19,120.72 0 top
R107  330R 1%  [EIA0603]  85.65,123.77 90 top
R108  R_2010EIA2010  [EIA2010]  60.55,103 90 top
R109  330R 1%  [EIA0603]  72.19,127.07 0 top
R110  220K 1%  [EIA0603]  84.12,123.77 270 top
R111  R_1206EIA1206  [EIA1206]  67.54,103 90 top
R112  B57364S100M54  [VARISTOR_D25_P7.5]  2.9,121.55 90 top
R113  R_2010EIA2010  [EIA2010]  64.36,103 90 top
R114  RNF12FTD10M0  [RES-RM12.5-VR37]  13.89,3.33 180 top
R115  RNF12FTD10M0  [RES-RM12.5-VR37]  41.07,3.21 180 top
R200  1K 1%  [EIA0603]  178.71,121.82 270 top
R201  3.3K 1%  [EIA0603]  64.44,32.42 90 top
R300  100K 1%  [EIA0603]  184,51.26 270 top
R301  47R 1%  [R2512]  198.04,177.32 0 top
R302  47R 1%  [R2512]  228.52,207.93 90 top
R303  4.7K 1%  [EIA0603]  163.84,192 90 top
R304  33R 1%  [EIA2010]  192.2,141.89 270 top
R305  10K 1%  [EIA0603]  178.67,45.41 180 top
R306  10K 1%  [EIA0603]  184,54.56 270 top
R307  10K 1%  [EIA0603]  186.61,57.06 180 top
R308  4.7k 1%  [EIA0603]  161.93,192 90 top
R309  1K 1%  [EIA2010]  195.5,196.37 90 top
R310  47R 1%  [R2512]  198.04,184.31 180 top
R311  47R 1%  [R2512]  232.84,202.09 90 top
R312  1K 1%  [EIA2010]  232.84,193.71 270 top
R313  33R 1%  [EIA2010]  187.38,141.89 270 top
R314  10k 1%  [EIA0603]  186.54,55.32 0 top
R315  1K 1%  [EIA0603]  128.87,50.81 270 top
R316  12R 1%  [EIA2512]  139.62,134.02 90 top
R317  10K 1%  [EIA0603]  177.65,56.84 90 top
R318  10K 1%  [EIA0603]  174.6,56.84 270 top
R319  10K 1%  [EIA0603]  173.08,56.84 90 top
R320  10K 1%  [EIA0603]  174.6,48.72 0 top
R321  10K 1%  [EIA0603]  180.7,56.84 270 top
R322  47R 1%  [R2512]  197.54,126.65 0 top
R323  47R 1%  [R2512]  268.66,124.62 270 top
R324  10K 1%  [EIA0603]  174.6,50.24 0 top
R325  33R 1%  [EIA2010]  193.02,201.37 180 top
R326  RNF12FTD10M0  [RES-RM12.5-VR37]  210.49,161.45 180 top
R327  22R 1%  [EIA2010]  193.02,205.18 180 top
R328  1K 1%  [EIA2010]  197.03,141.64 90 top
R329  47R 1%  [R2512]  197.54,132.49 180 top
R330  47R 1%  [R2512]  264.59,130.46 270 top
R331  1K 1%  [EIA2010]  260.27,139.85 90 top
R332  33R 1%  [EIA2010]  232.84,186.85 270 top
R333  150K 1%  [EIA0603]  170.95,39.09 90 top
R334  100K 1%  [EIA0603]  181.36,40.87 0 top
R335  1.5K 1%  [EIA0603]  186.19,39.34 180 top
R336  10K 1%  [EIA0603]  163.83,44.17 180 top
R337  510R 1%  [EIA0603]  181.36,39.34 180 top
R338  33K 1%  [EIA0603]  172.72,33.76 90 top
R339  162R 1%  [EIA0603]  176.53,32.99 180 top
R340  WSL5931L3000FEA  [WSLP3921]  348.85,16.92 180 top
R341  510R 1%  [EIA0603]  183.14,32.99 180 top
R342  220k 1%  [EIA0603]  174.25,33.76 90 top
R343  10k 1%  [EIA0603]  175.77,35.28 90 top
R344  1.5K 1%  [EIA0603]  186.19,34.77 180 top
R345  100K 1%  [EIA0603]  179.71,32.99 180 top
R346  3.3K 1%  [EIA0603]  168.15,33.76 270 top
R347  3.3K 1%  [EIA0603]  165.1,33.76 90 top
R348  3.3K 1%  [EIA0603]  167.9,39.09 90 top
R349  1K 1%  [EIA0603]  165.1,41.88 0 top
R350  10K 1%  [EIA0603]  171.2,33.76 90 top
R351  10K 1%  [EIA0603]  165.1,40.36 0 top
R352  10R 1%  [EIA0603]  109.14,67.47 180 top
R353  0R 1%  [EIA0603]  144.62,79.91 90 top
R354  10R 1%  [EIA0603]  109.32,64.67 180 top
R355  412R 1%  [EIA0603]  144.62,76.61 270 top
R356  1.2K 1%  [EIA0603]  142.08,81.43 180 top
R357  49.9K 1%  [EIA0603]  109.32,61.62 180 top
R358  10R 1%  [EIA0603]  142.08,75.85 0 top
R359  49.9K 1%  [EIA0603]  109.32,60.1 180 top
R360  65K 1%  [EIA0603]  109.32,58.57 180 top
R361  0R 1%  [EIA0603]  144.62,72.29 90 top
R362  65K 1%  [EIA0603]  109.32,57.05 180 top
R363  10K 1%  [EIA0603]  123.29,50.81 90 top
R364  412R 1%  [EIA0603]  144.62,68.73 270 top
R365  100K 1%  [EIA0603]  109.32,55.53 180 top
R366  10K 1%  [EIA0603]  121.51,50.81 90 top
R367  1.2K 1%  [EIA0603]  142.08,73.05 180 top
R368  100K 1%  [EIA0603]  109.32,54 180 top
R369  150K 1%  [EIA0603]  114.1,50.81 270 top
R370  10R 1%  [EIA0603]  142.08,67.46 0 top
R371  18K 1%  [EIA0603]  112.45,50.81 270 top
R372  10R 1%  [EIA2512]  180.77,147.73 180 top
R373  0R 1%  [EIA0603]  144.62,63.65 90 top
R374  18K 1%  [EIA0603]  115.92,50.81 90 top
R375  620R 1%  [EIA0603]  119.73,50.81 270 top
R376  620R 1%  [EIA0603]  125.32,50.81 270 top
R377  412R 1%  [EIA0603]  144.62,60.35 270 top
R378  1.2K 1%  [EIA0603]  142.08,64.42 180 top
R379  0R 1%  [EIA0603]  117.95,50.81 90 top
R380  10R 1%  [EIA0603]  142.08,58.83 0 top
R381  0R 1%  [EIA0603]  144.62,55.02 90 top
R382  412R 1%  [EIA0603]  144.62,51.72 270 top
R383  1.2K 1%  [EIA0603]  142.08,55.78 180 top
R384  10R 1%  [EIA0603]  142.08,50.19 0 top
R385  22R 1%  [EIA2010]  229.29,186.85 270 top
R386  10K 1%  [EIA0603]  130.73,50.81 270 top
R387  33R 1%  [EIA2010]  256.63,143.24 270 top
R388  10K 1%  [EIA0603]  99.72,50.81 90 top
R389  825K 1%  [EIA0603]  106.58,50.81 90 top
R390  4.7k 1%  [EIA0603]  160.03,192 90 top
R391  3.3K 1%  [EIA0603]  101.28,50.81 270 top
R396  33R 1%  [EIA2010]  253.08,143.24 270 top
R397  5.6K 1%  [EIA0603]  187.25,191.93 90 top
R398  RNF12FTD10M0  [RES-RM12.5-VR37]  204.65,157.13 0 top
R399  33K 1%  [EIA0603]  174.83,176.02 180 top
R400  10k 1%  [EIA0603]  174.83,171.58 180 top
R401  10R 1%  [EIA2512]  281.59,214.82 0 top
R402  33K 1%  [EIA0603]  253.82,205.57 0 top
R403  10k 1%  [EIA0603]  253.82,209.63 0 top
R404  220R 1%  [EIA0603]  191.06,191.93 90 top
R405  2.2K 1%  [EIA0603]  183.44,191.93 90 top
R406  5.6K 1%  [EIA0603]  186.95,125.4 90 top
R407  4.7K 1%  [EIA0603]  163.49,125.72 90 top
R408  4.7k 1%  [EIA0603]  161.58,125.72 90 top
R409  4.7k 1%  [EIA0603]  159.68,125.72 90 top
R410  220R 1%  [EIA0603]  188.22,131.11 180 top
R411  2.2K 1%  [EIA0603]  182.51,125.4 270 top
R412  5.6K 1%  [EIA0603]  241.49,186.85 90 top
R413  4.7K 1%  [EIA0603]  261.84,187.8 270 top
R414  4.7k 1%  [EIA0603]  263.75,187.8 270 top
R415  4.7k 1%  [EIA0603]  265.65,187.8 270 top
R416  220R 1%  [EIA0603]  237.68,186.85 270 top
R417  2.2K 1%  [EIA0603]  243.39,186.85 270 top
R418  5.6K 1%  [EIA0603]  250.36,129.45 0 top
R419  4.7K 1%  [EIA0603]  231.62,133.25 90 top
R420  4.7k 1%  [EIA0603]  228.78,133.25 90 top
R421  4.7k 1%  [EIA0603]  226.75,133.25 90 top
R422  220R 1%  [EIA0603]  250.99,126.91 90 top
R423  2.2K 1%  [EIA0603]  247.82,134.53 90 top
R424  10R 1%  [EIA2512]  180.77,151.8 180 top
R425  5.6K 1%  [EIA0603]  185.34,191.93 270 top
R426  5.6k 1%  [EIA0603]  184.41,125.4 90 top
R427  10R 1%  [EIA2512]  281.59,218.88 0 top
R428  5.6K 1%  [EIA0603]  239.58,186.85 270 top
R429  5.6k 1%  [EIA0603]  250.37,131.22 180 top
R430  412R 1%  [EIA0603]  174.7,158.63 0 top
R431  412R 1%  [EIA0603]  258.24,220.12 180 top
R432  3.9K 1%  [EIA0603]  171.53,158.63 180 top
R433  3.9K 1%  [EIA0603]  261.29,220.12 0 top
R434  15.8K 1%  [EIA0603]  188.9,57.82 90 top
R435  15.8K 1%  [EIA0603]  192.26,54.36 270 top
R436  41K 1%  [EIA2010]  194.8,56.14 270 top
R437  100K 1%  [EIA0603]  190.48,54.36 270 top
R438  1.2K 1%  [EIA2010]  199.88,54.62 180 top
R439  RR02J22RTB  [RES-RM15-RSF1W]  255.96,48.29 90 top
R440  RR02J22RTB  [RES-RM15-RSF1W]  255.96,68.74 90 top
R441  RR02J22RTB  [RES-RM15-RSF1W]  310.98,30.43 270 top
R442  RR02J22RTB  [RES-RM15-RSF1W]  299.83,23.02 180 top
R443  100R 1%  [EIA0603]  151.57,54.62 270 top
R444  100R 1%  [EIA0603]  159.7,54.62 270 top
R445  100R 1%  [EIA0603]  148.27,54.62 270 top
R446  100R 1%  [EIA0603]  156.4,54.62 270 top
R447  100R 1%  [EIA0603]  196.01,45.88 180 top
R448  100R 1%  [EIA0603]  196.01,42.32 180 top
R449  10K 1%  [EIA0603]  155.91,7.53 90 top
R450  10K 1%  [EIA0603]  131.52,10.57 180 top
R451  0R 1%  [EIA0603]  131.52,12.1 180 top
R452  100R 1%  [EIA0603]  154.61,36.35 0 top
R461  10R 1%  [EIA0603]  154.61,39.53 180 top
R462  10R 1%  [EIA0603]  147.75,43.34 0 top
R463  10K 1%  [EIA0603]  150.04,42.58 90 top
R500  10K 1%  [EIA0603]  168.1,11.08 90 top
R501  10K 1%  [EIA0603]  168.07,7.78 90 top
R502  100R 1%  [EIA0603]  158.96,7.53 90 top
R503  10K 1%  [EIA0603]  157.43,7.53 270 top
R504  1K 1%  [EIA0603]  188.79,28.53 180 top
R505  10K 1%  [EIA0603]  176.69,11.08 90 top
R506  100R 1%  [EIA0603]  188.79,26.53 0 top
R507  10K 1%  [EIA0603]  176.69,7.78 90 top
R508  100R 1%  [EIA0603]  162,7.53 90 top
R509  1K 1%  [EIA0603]  188.79,24.93 180 top
R510  10K 1%  [EIA0603]  160.48,7.53 270 top
R511  100R 1%  [EIA0603]  188.82,23.01 0 top
R512  10K 1%  [EIA0603]  185.32,11.08 90 top
R513  100R 1%  [EIA0603]  188.82,21.48 180 top
R514  10K 1%  [EIA0603]  185.32,7.78 90 top
R515  10K 1%  [EIA0603]  123.32,15.11 0 top
R516  10K 1%  [EIA0603]  120.78,14.34 270 top
R517  100R 1%  [EIA0603]  165.05,7.53 90 top
R518  100R 1%  [EIA0603]  188.82,19.45 0 top
R519  10K 1%  [EIA0603]  163.53,7.53 270 top
R520  470R 1%  [EIA0603]  123.26,19.79 0 top
R521  100R 1%  [EIA0603]  105.84,15.4 90 top
R522  470R 1%  [EIA0603]  123.26,18.27 0 top
R523  100R 1%  [EIA0603]  110.67,15.4 90 top
R524  100R 1%  [EIA0603]  188.82,17.93 180 top
R525  470R 1%  [EIA0603]  123.3,16.77 0 top
R526  0R 1%  [EIA0603]  92.63,15.91 180 top
R527  0R 1%  [EIA0603]  92.63,14.38 180 top
R528  100R 1%  [EIA0603]  188.82,15.89 0 top
T300  IHW20N120R5  [TO-247AC]  224.22,195 180 top
T301  IHW20N120R5  [TO-247AC]  205.78,195 0 top
T302  2N7002  [SOT23]  174.6,53.03 0 top
T303  IHW20N120R5  [TO-247AC]  269.11,139.86 0 top
T304  IHW20N120R5  [TO-247AC]  205.78,139.86 0 top
T307  2N7002  [SOT23]  141.83,78.64 180 top
T308  2N7002  [SOT23]  141.83,70.26 180 top
T309  2N7002  [SOT23]  141.83,61.62 180 top
T310  2N7002  [SOT23]  141.83,52.99 180 top
T313  2N7002  [SOT23]  152.83,42.32 270 top
T500  2N7002  [SOT23]  158.19,4.22 270 top
T501  2N7002  [SOT23]  162.26,4.22 270 top
T502  2N7002  [SOT23]  166.32,4.22 270 top
TR300  CST206-2A  [CST206-2A]  137.08,176.38 90 top
TR305  11-0060-A  [11-0060-A]  360.1,99.95 0 top
U300  PAD_3MMX6MM  [PAD-3.0X6.0MM]  130.67,218 0 top
U301  PAD_3MMX6MM  [PAD-3.0X6.0MM]  145.02,218 0 top
V100  B72205S0271K101B72205S2131K101  [EPCOS_B72205S0271K101_0]  11.99,19.59 0 top
V300  B72205S0271K101B72205S2131K101  [EPCOS_B72205S0271K101_0]  297.1,11.84 180 top
V400  0603ESDA-24NSMD  [EIA0603]  162.49,54.62 90 top
V401  0603ESDA-24NSMD  [EIA0603]  167.57,54.62 90 top
V402  0603ESDA-24NSMD  [EIA0603]  165.03,54.62 90 top
V500  0603ESDA-24NSMD  [EIA0603]  172.42,5.24 0 top
V501  0603ESDA-24NSMD  [EIA0603]  181.05,5.24 0 top
V502  0603ESDA-24NSMD  [EIA0603]  189.69,5.24 0 top
V503  0603ESDA-24NSMD  [EIA0603]  109.14,15.4 270 top
V504  0603ESDA-24NSMD  [EIA0603]  107.37,15.4 270 top
X1  726386-2TE_726386-2  [TE_726386-2]  22.27,12.35 180 top
X2  7461061  [X01_M10_7461061]  249.43,16.96 0 top
X3  726386-2TE_726386-2  [TE_726386-2]  5.25,12.29 180 top
X4  7461061  [X01_M10_7461061]  324.47,16.96 0 top
X5  615008148521  [615008148521]  104.76,7 0 top
X6  615008148521  [615008148521]  86.84,7 0 top
X7  2304-6111-TP  [X04_100MIL]  200.57,14.25 270 top
X8  2304-6111-TP  [X04_100MIL]  200.57,26.45 270 top
X100  01020071Z  [FUSE_CLIP_01020071Z]  36.06,14.02 270 top
X101  01020071Z  [FUSE_CLIP_01020071Z]  36.06,43.14 90 top
X200  726386-2TE_726386-2  [TE_726386-2]  22.27,51.33 180 top
X201  726386-2TE_726386-2  [TE_726386-2]  22.27,40.6 180 top
X202  726386-2TE_726386-2  [TE_726386-2]  5.25,40.6 180 top
X203  726386-2TE_726386-2  [TE_726386-2]  5.25,51.33 180 top
X204  MOLEX_206832-0601MOLEX_206832-0601  [MOLEX_206832-0601]  72.95,5.45 180 top
X205  MOLEX_206832-0601MOLEX_206832-0601  [MOLEX_206832-0601]  191.88,99.94 180 top
X400  2304-6111-TP  [X04_100MIL]  200.57,47.27 270 top
X401  2304-6111-TP  [X04_100MIL]  170.11,59.19 180 top
X402  2304-6111-TP  [X04_100MIL]  150.55,59.19 0 top
X403  WF2549-2WS05S0B01  [X10_100MIL_2XROW_VERT]  171.15,21.24 0 top

## Tracks (layer width: path | path; a pad name or v marks a point on that pad's centre or on a via)
/DO_COMM_RX_EN
  Top 0.203: IC400.32 138.21,5.59 127.51,5.59 127.13,5.97 127.13,17.65 124.99,19.79 R520.2
/G_DRV_FAULTA  (via drill 0.3 pad 0.6)  (1 unrouted)
  Top 0.203: C404.2 R445.1 | R445.1 | IC400.89 156.84,32.71 156.84,46.23 150.62,52.45 150.62,54.59
  Top 0.508: C404.2 149.79,58.43 X402.1 | IC306.13 163.67,195.81 C371.2
  L1 0.508: X402.1 150.55,74.81 160.61,84.87 160.61,141.4 156.29,145.72 156.29,181.56 161.93,187.2 161.93,192.66 161.93,192.65 R308.2 C371.2 | C371.2 161.93,197.6 161.93,197.61 C371.2
  other vias: 161.93,192.8 161.93,197.55
/G_DRV_FAULTB  (via drill 0.3 pad 0.6)  (4 unrouted)
  Top 0.203: C405.2 | C405.2 R443.1 | X402.2 159.38,65.48 159.38,75.95 162.25,78.82 v162.25,81.05 | IC400.88 157.35,32.51 157.35,46.48 153.92,49.91 153.92,54.59
  Top 0.508: IC307.13 163.47,129.26 C374.2 | C405.2 X402.2 | X402.2
  L1 0.508: v162.25,81.05 162.25,122.86 161.54,123.57 v161.54,131.06
  other vias: 161.56,126.49
/G_DRV_FAULTC  (via drill 0.3 pad 0.6, 0.35)  (1 unrouted)
  Top 0.203: R446.1 C403.2 | C403.2 | X402.3 159.89,63.45 159.89,74.22 v160.22,74.55 | IC400.87 157.86,32.31 157.86,46.74 157.23,47.37 157.23,54.59
  Top 0.508: C403.2 154.87,58.43 X402.3 | IC310.13 262.92,184.37 263.75,183.54 C377.2
  L1 0.508: v160.22,74.55 223.44,74.55 231.09,82.19 231.09,147.22 239.37,155.5 258.47,155.5 263.8,160.83 263.8,182.27 263.77,182.27 C377.2 R414.2
  other vias: 263.75,182.25 263.75,187
/G_DRV_FAULTD  (via drill 0.3 pad 0.6, 0.35)  (2 unrouted)
  Top 0.152: 160.53,48.9 160.53,54.61
  Top 0.203: R444.1 C407.2 | C407.2 | X402.4 160.4,61.42 160.4,73.61 162.23,75.44 v162.23,76.3 | IC400.86 158.37,32.11 158.37,46.74 160.53,48.9 | 160.53,54.61 159.72,55.42
  Top 0.508: C407.2 X402.4 | X402.4 | IC311.13 229.5,136.81 228.78,137.54 C380.2 | v228.82,134.05 R420.2
  L1 0.508: v162.23,76.3 222.4,76.3 228.8,82.7 228.8,82.71 228.8,133.23 | 228.8,133.23 228.82,133.21 | 228.8,133.23 228.8,134.05 v228.82,134.05 v228.82,138.8 | v228.82,138.8 228.82,138.82 228.8,138.84 228.8,138.81 v228.82,138.8
AI_I_OUT  (via drill 0.35)
  Top 0.203: IC400.113 142.85,32.38 v143,32.38 | v178.31,29.08 178.31,29.72 178.95,30.36 C433.2 178.95,32.95 R345.2
  Top 0.508: R345.2 R339.1 177.33,35.48 177.88,36.02 180.09,36.02 180.28,36.21 IC301.1
  Bottom 0.203: v143,32.38 145.29,32.38 150.11,27.56 166.37,27.56 167.89,29.08 v178.31,29.08
AN_OUTA_H
  Top 0.508: IC306.4 182.09,195.81 182.12,195.83
  Top 1.27: 182.12,195.83 185.93,195.83 190.72,200.62 R325.2
AN_OUTA_L
  Top 0.508: IC306.6 181.33,198.35 181.36,198.37
  Top 1.27: 181.33,198.35 184.13,198.35 185.93,200.15 185.93,203.84 187.27,205.18 R327.2
AN_OUTB_H
  Top 0.61: IC307.4 178.03,129.26 178.18,129.41
  Top 1.27: R304.2 182.02,129.41 178.18,129.41
AN_OUTB_L
  Top 0.61: 179.2,131.73 179.13,131.8 IC307.6
  Top 1.27: R313.2 187.38,138.74 180.37,131.73 179.2,131.73
AN_OUTC_H
  Top 0.61: 248.36,184.3 248.43,184.37 IC310.4
  Top 1.016: R332.2 233.09,184.3 248.36,184.3
AN_OUTC_L
  Top 1.016: R385.2 229.29,182.75 230.21,181.83 IC310.6
AN_OUTD_H
  Top 1.016: IC311.4 248.91,136.81 248.92,136.8 250.7,136.8 252.13,138.23 255.02,138.23 256.63,139.85 R387.2
AN_OUTD_L
  Top 0.61: IC311.6 245.51,139.35 245.52,139.34
  Top 1.016: 245.52,139.34 250.52,139.34 252.11,140.94 R396.2
BCD_A
  Top 0.508: X8.1 198.6,26.45 197.25,27.79 C500.1 193.69,27.79 Q501.3
BCD_B
  Top 0.508: X8.2 200.54,23.88 197.99,23.88 197.38,24.49 195.45,24.49 C501.1 193.94,24.49 Q503.3
BCD_C
  Top 0.508: X8.3 200.49,21.44 195.45,21.44 C502.1 194.45,21.44 Q505.3
BCD_D
  Top 0.508: X8.4 197.77,18.83 197.34,18.4 C506.1 194.96,18.4 Q507.3
CTRLR_OUTA
  Top 0.254: IC1.22 134.02,61.88 135.13,62.99 135.13,73.79 137.19,75.85 R358.1
CTRLR_OUTB
  Top 0.254: IC1.21 134.51,61.23 135.76,62.48 135.76,66.29 136.93,67.47 R370.1
CTRLR_OUTC
  Top 0.254: R380.1 132.81,58.83 131.06,60.58 IC1.20
CTRLR_OUTD
  Top 0.254: IC1.19 130.82,59.93 132.46,58.29 132.46,50.8 133.07,50.19 R384.1
DBG_TDI
  Top 0.203: IC400.75 158.8,24.77 163.81,24.77 X403.1
DGB_SWDIO_TCK
  Top 0.203: IC400.72 160.66,17.4 171.83,17.4 172.47,18.03 172.47,21.21 173.69,22.43 X403.7
DGB_SWDIO_TDO
  Top 0.203: IC400.74 159,24.26 161.8,24.26 164.91,21.14 167.24,21.14 X403.3
DGB_SWDIO_TMS  (via drill 0.35)
  Top 0.203: IC400.73 159.07,23.62 v160.27,23.62 | v166.88,23.88 169.78,23.88 X403.5
  Bottom 0.203: v160.27,23.62 160.53,23.88 v166.88,23.88
DI_G_DRV_RDY  (via drill 0.3 pad 0.6, 0.35)  (1 unrouted)
  Top 0.152: 160.78,48.39 160.78,73
  Top 0.203: IC400.85 158.88,31.91 158.88,46.48 160.78,48.39 | v163.27,75.41 163.23,75.45 160.78,73
  Top 0.508: R448.1 | R448.1 C400.2 198.41,44.1 199.04,44.73 X400.2 | v163.22,114.88 163.27,114.83 v163.27,75.41 | IC307.12 164.1,130.53 C373.2 | IC306.12 164.31,197.08 C370.2 | C376.2 260.99,183.1 IC310.12 | IC311.12 232.28,138.08 C379.2 230.08,138.74 v229.97,138.63 | v229.97,133.86 230.16,134.05 R419.2
  L1 0.508: v163.22,114.88 163.23,114.88 163.23,126.27 R407.2 C373.2 163.49,139.92 157.23,146.18 157.23,180.85 163.83,187.45 R303.2 163.84,197.48 163.83,197.49 C370.2 | v163.27,75.41 222.83,75.41 229.97,82.55 v229.97,133.86 v229.97,138.63 229.97,147.62 238.81,156.46 257.76,156.46 262.3,161 262.3,181.7 261.82,182.17 261.82,182.23 C376.2 261.85,186.91 261.87,186.94 261.87,186.97 R413.2
  other vias: 163.49,126.52 163.49,131.14 163.84,192.8 163.84,192.8 163.84,197.55 261.84,182.25 261.84,187
DI_UART_RX
  Top 0.152: 125.48,7.75 125.48,11.51 Q506.3
  Top 0.203: IC400.35 138.68,3.94 126.75,3.94 125.48,5.21 125.48,7.75 125.48,7.87 | Q506.3 124.12,12.87 R515.2
DISP1_VCC  (1 unrouted)
  Top 0.152: V502.2 189.61,6.12 189.61,8
  Top 0.508: Q504.2 Q504.4 | V502.2 193.69,5.24 198.9,14.25 X7.1
DISP2_VCC
  Top 0.508: Q502.4 Q502.2 181.85,6.37 V501.2 | V501.2 181.86,5.23 | X7.2 199.03,11.71 194.43,3.3 183.13,3.3 181.85,4.58 V501.2
DISP3_VCC  (1 unrouted)
  Top 0.508: Q500.2 Q500.4 | X7.3 199.23,9.17 195.39,1.52 175.13,1.52 173.22,3.44 V500.2
DO_7SEG_BCD_A
  Top 0.203: IC400.71 160.34,17.02 178.94,17.02 184.66,22.73 184.66,25.27 187.92,28.53 R504.2
DO_7SEG_BCD_B
  Top 0.203: IC400.70 160.01,16.64 179.07,16.64 187.37,24.93 R509.2
DO_7SEG_BCD_C
  Top 0.203: IC400.69 159.68,16.26 179.2,16.26 184.42,21.48 R513.2
DO_7SEG_BCD_D
  Top 0.203: IC400.66 156.03,17.78 156.9,16.91 156.9,16.2 159,14.1 166.88,14.1 168.66,15.88 179.32,15.88 181.38,17.93 R524.2
DO_7SEG_DISP1_EN
  Top 0.203: IC400.65 156.46,16.65 156.46,16 162.18,10.29 163.83,10.29 165.05,9.06 R517.2
DO_7SEG_DISP2_EN
  Top 0.203: IC400.64 156.11,16.3 156.11,15.73 162,9.83 R508.2
DO_7SEG_DISP3_EN
  Top 0.203: IC400.63 155.7,15.99 155.7,15.49 158.96,12.24 R502.2
DO_ABRUPT_I_OFF  (via drill 0.35)
  Top 0.203: IC400.118 138.94,32.76 v138.94,32.89 | v146.94,40.89 146.94,43.33 R462.1
  Bottom 0.203: v138.94,32.89 v146.94,40.89
DO_COMM_TX_EN
  Top 0.203: IC400.33 138.28,4.95 127.25,4.95 126.49,5.71 126.49,16.76 125.41,17.84 125.35,17.91 124.99,18.27 R522.2
DO_I_SET_PWM  (via drill 0.35)
  Top 0.203: IC400.97 150.74,32.26 150.75,32.26 v150.88,32.38 | v163.07,41.78 163.17,41.88 R349.1 | v169.29,55.37 167.62,55.37 V401.2
  Top 0.508: V401.2 X401.2 | X401.2
  Bottom 0.203: v150.88,32.38 152.53,34.04 157.35,34.04 163.07,39.75 v163.07,41.78 165.99,41.78 169.29,45.09 v169.29,55.37
DO_UART_TX
  Top 0.203: IC400.34 138.48,4.45 127,4.45 125.98,5.46 125.98,15.64 124.86,16.77 R525.2
DO_V_SET_PWM
  Top 0.203: V402.2 166.24,54.21 166.24,51.94 168.66,49.53 172.94,49.53 173.76,48.72 R320.1
  Top 0.508: V402.2 X401.3 | X401.3
EA_IN  (via drill 0.35)
  Top 0.508: R336.2 163.03,46.26 | 163.03,46.26 D306.2 161.52,46.45 v160.27,45.21 | D302.2 177.87,47.5 R305.2 172.52,45.41 169.29,48.64 163.96,48.64 163.03,47.72 163.03,46.26 | R461.1 155.41,40.6 155.83,41.02 155.83,44.83 v156.21,45.21
  L2 0.508: v156.21,45.21 v160.27,45.21
FLOATING
  pour Top (hatched): 291.34,231.78 291.34,225.68 304.93,212.09 304.93,187.71 304.42,187.2 307.85,183.77 310.26,183.77 394.59,183.77 396.88,186.06 396.88,230 395.1,231.78
G_DRV1_VCC  (2 unrouted)
  Top 0.305: R303.1 164.78,191.2 165.1,191.52 165.1,192.91 165.46,193.27 IC306.15
  Top 0.508: C333.2 163.79,189.63 L302.2 R303.1 R390.1
G_DRV2_VCC  (2 unrouted)
  Top 0.305: R409.1 R407.1 L304.2 159.73,123.39 C344.2
  Top 0.508: R407.1 164.8,124.92 164.97,125.09 164.97,126.11 165.58,126.72 IC307.15
G_DRV3_VCC  (1 unrouted)
  Top 0.508: R413.1 263.7,188.6 | 263.7,188.6 R415.1 C360.2 261.89,190.18 L308.2 261.83,190.14 259.33,190.14 258.21,189.02 258.21,187.61 258.91,186.91 IC310.15 | C361.2 263.75,188.65 263.7,188.6
G_DRV4_VCC
  Top 0.508: R419.1 231.86,132.45 233.69,134.27 IC311.15
  Top 0.61: R421.1 227.74,131.46 C364.2 C363.2 231.52,130.24 L309.2 231.57,132.4 R419.1 R420.1 R421.1
G_DRV_INA  (via drill 0.3 pad 0.6)
  Top 0.508: R353.1 R355.1 145.99,77.41 v146.3,77.72 | v165.99,199.52 166.09,199.62 IC306.10
  L1 0.508: v146.3,77.72 151.64,77.72 155.32,81.41 155.32,181.99 160.15,186.82 160.15,197.87 161.16,198.88 165.35,198.88 v165.99,199.52
G_DRV_INB
  Top 0.508: R364.1 R361.1 146.42,71.49 159.64,84.71 159.64,114.81 155.96,118.49 155.96,133.22 157.1,134.37 163.7,134.37 165,133.07 IC307.10
G_DRV_INC  (via drill 0.3 pad 0.6, 0.35)
  Top 0.508: R377.1 R373.1 145.41,62.85 147.45,64.9 147.45,67.31 v157.33,77.19 | IC310.10 260.15,180.56 261.42,179.3 v261.42,177.29
  L1 0.508: v157.33,77.19 221.97,77.19 227.94,83.16 227.94,141.25 228.31,141.62 228.31,148.66 237.95,158.29 258.01,158.29 261.42,161.7 v261.42,177.29
G_DRV_IND  (via drill 0.35)
  Top 0.508: R382.1 R381.1 145.71,54.22 v145.8,54.3 | IC311.10 233.11,140.62 232.68,141.06 232.68,141.07 232.07,141.68 v227.13,141.68
  L1 0.508: v157.84,78.12 221.42,78.12 227.13,83.82 v227.13,141.68
  Bottom 0.508: v145.8,54.3 147.78,56.29 147.78,69.34 156.57,78.13 v157.84,78.13 v157.84,78.12
GND  (via drill 0.3, 0.3 pad 0.6, 0.35, 0.35 pad 0.6)  (2 unrouted)
  Top 0.2: v28.57,123.19 29.32,123.19 29.47,123.04 30.48,123.04
  Top 0.203: R389.1 106.48,49.91 Q300.2 105.04,48.88 v105.54,48.39 | IC400.141 130.81,24.62 v130.81,25.02 | IC400.128 135.42,29.21 v134.75,29.21 | IC400.67 157.61,16.92 v157.61,16.64 | C450.2 C440.2 152.86,5.67 v152.65,5.46 | R503.1 157.43,9.1 v157.86,9.53 | R510.1 160.48,9.22 160.78,9.53 v160.72,9.59 | R519.1 163.53,9.1 v163.83,9.39 v163.83,9.4 | R463.1 150.44,41.37 T313.2 151.73,40.48 151.51,40.26 v151.38,40.26 | C444.1 151.35,35.14 v151,34.8 | IC400.100 149.22,32.87 149.22,33.91 v148.97,34.16 | C445.2 139.12,38.66 v139.7,39.24 | C446.2 137.59,38.56 v136.91,39.24 | v135.13,37.47 135.5,37.09 C458.2 C455.2 132.45,37.22 v132.08,37.59 | C457.2 133.98,37.09 v133.73,37.34 | C503.1 119.33,12.37 v119.51,12.19 | C504.1 v113.53,14.6 v113.54,14.61 | V503.1 109.09,16.25 v109.09,17.27 | V504.1 107.37,17.2 v107.44,17.27 | IC400.18 135.68,12.95 v135,12.95 | C451.1 130.05,14.3 v130.05,14.73 | IC400.82 155.83,26.74 v155.83,26.93 | IC400.112 142.79,33.15 v143.89,33.15 | IC400.122 137.37,31.5 v137.03,31.5 | IC400.48 150.5,10.6 v150.5,9.78 | C439.1 130.05,8.15 v130.05,7.24
  Top 0.254: D324.1 132.62,46.45 v132.84,46.23 | IC1.24 124.01,63.18 v124.33,63.5 | C320.1 C422.2 | C422.2 | R375.2 119.76,49.98 | R386.2 131.6,50.01 v131.83,49.78 | R379.1
  Top 0.508: R371.2 111.15,50.01 v111,50.16 | C337.2 C338.1 | C338.1 | C422.2 127.6,68.29 v127.76,68.45 | R365.2 107.34,55.53 v107.31,55.5 | R362.2 107.34,57.05 v107.31,57.02 | R360.2 107.34,58.58 v107.31,58.55 | R359.2 107.47,60.1 v107.44,60.07 | R357.2 107.34,61.62 v107.31,61.59 | C324.1 107.34,63.15 v107.31,63.12 | R375.2 R379.1 117.95,48.54 v117.98,48.51 | R375.2 | R376.2 | R376.2 C306.1 127.13,49.98 v127.13,48.92 127.13,48.9 | R375.2 119.73,48.54 v119.76,48.51 | R376.2 125.32,48.92 125.35,48.9 v125.35,48.92 | T500.2 155.55,3.27 v155.32,3.05 | T501.2 160.25,3.27 v159.51,2.54 | T502.2 164.82,3.27 v163.96,2.41 | V500.1 171.62,3.85 v170.94,3.17 | V502.1 186.91,5.24 v186.69,5.46 | V501.1 180.25,3.98 v179.45,3.17 | C448.1 C449.1 v160.15,21.33 v160.15,21.34 | R528.1 188.02,16.69 v188.09,16.76 | R518.1 187.09,19.45 v187.07,19.43 | R511.1 188,22.99 v187.07,22.99 | R506.1 v187.08,26.53 v187.07,26.54 | C500.2 196.54,29.39 v196.72,29.21 | C501.2 196.41,26.09 v196.72,25.78 | C502.2 196.16,23.04 v196.47,22.73 | C506.2 196.41,20 196.85,19.56 v196.91,19.62 | C402.1 195.18,40.51 v194.18,40.51 | C400.1 193.71,44.1 v193.55,43.94 | C401.1 193.71,47.66 v193.55,47.5 | R350.1 C317.2 v169.68,31.37 v169.67,31.37 | R350.1 | R351.1 164.15,40.21 Q306.2 164.15,36.14 v163.19,35.18 | C318.2 v166.63,34.55 v166.62,34.54 | C314.2 191.03,37.06 v191.52,36.58 | R334.2 182.16,42.46 C383.1 183.31,42.5 v183.64,42.16 | C421.1 177.25,30.31 v176.91,29.97 | IC302.2 v173.49,41.91 v173.48,41.91 | v179.32,38.56 v179.33,38.55 IC301.2 | C347.2 182.37,37.34 v181.36,37.34 | R324.1 173.75,50.29 171.32,50.29 v170.69,50.93 | C309.2 R321.1 | R321.1 | R321.1 180.7,59.03 v181.1,59.44
  Top 0.508: C310.2 176.13,55.01 | 176.13,55.01 v176.15,54.99 | C346.2 176.14,55.01 176.13,55.01 | T302.2 175.55,53 175.77,53.21 v175.77,53.34 | IC300.2 181.46,49.49 182.59,49.49 v182.63,49.53 | C417.2 190.48,59.92 v191.01,60.45 | C416.2 185.81,61.33 v185.8,61.34 | R437.2 189.61,52.69 v189.61,52.58 | V400.1 162.49,52.65 v162.81,52.32 | V402.1 165.03,52.77 v165.35,52.45 | V401.1 167.57,52.76 v167.26,52.45 | C407.1 158.17,52.64 v157.99,52.45 | C403.1 154.94,53.75 v154.94,52.58 | C405.1 153.09,52.64 v152.91,52.45 | C404.1 149.79,52.51 v149.61,52.32 | C323.1 138.78,80.87 v138.94,81.03 | R355.2 146.42,75.81 146.94,76.33 v146.94,76.45 | C325.2 137.26,71.53 v137.16,71.63 | C328.1 139.03,71.53 v138.81,71.75 | R364.2 v146.04,67.94 v146.05,67.94 | R377.2 145.91,59.55 145.92,59.56 v146.05,59.56 | C329.1 139.29,63.02 v138.94,63.37 | C334.1 139.29,54.45 v139.32,54.48 | R382.2 144.62,49.69 v144.65,49.66 | TR300.1 137.08,145.97 135.25,144.15 135.25,135.44 R316.1 142.11,128.58 142.11,99.69 129.67,87.25 v129.67,77.34 | C375.1 C373.1 163.93,132.74 164.87,131.8 IC307.11 167.61,131.8 168.02,132.21 168.02,134.11 167.79,134.34 IC307.9 | C332.1 C333.1 | C372.1 C370.1 | C370.1 165.58,200.89 IC306.9 | IC306.11 167.22,198.37 165.61,198.37 164.83,199.15 C370.1 | IC310.9 258.96,179.29 258.17,180.09 258.17,181.41 258.59,181.83 IC310.11 260.48,181.83 260.79,181.53 260.79,181.52 261.66,180.65 C376.1 C378.1 267.17,180.65 267.72,181.2 v267.72,189.89 267.72,190.86 266.79,191.78 C360.1 C361.1 | C381.1 231.57,140.4 C379.1 231.97,140.34 232.96,139.35 IC311.11 235.06,139.35 235.67,139.97 235.67,141.06 235.66,141.08 235.66,141.22 234.99,141.89 IC311.9
  Top 0.61: C372.1 159.03,200.15 v159,200.15 | C364.1 C363.1
  Top 0.635: R344.1 203.35,34.77 235.33,2.79 347.98,2.79 349.63,4.45 349.63,15.88 350.68,16.92 R340.1
  Top 1.016: C108.1 48.44,26.36 v49.4,25.4
  Top 12.7: TR305.2 353.83,84.95 367.03,71.75 367.03,51.44
  L1 0.508: 175.39,79.38 221,79.38 226.11,84.48 226.11,147.78 237.43,159.1 256.99,159.1 259.99,162.1 259.99,191.87 260.3,192.18
  L1 0.61: v138.94,81.03 153.72,81.03 154.18,81.48 154.18,182.37 158.5,186.69 158.5,199.64 v159,200.15 | v158.88,79.38 175.39,79.38
  Bottom 12.7: TR305.4 368.83,69.95 353.83,84.95 TR305.2
  Bottom 7.62: TR305.4 380.1,10.27 374.65,4.83 206.63,4.83 205.74,5.71